# EAGLE design Main (EAGLE 9.3.0)
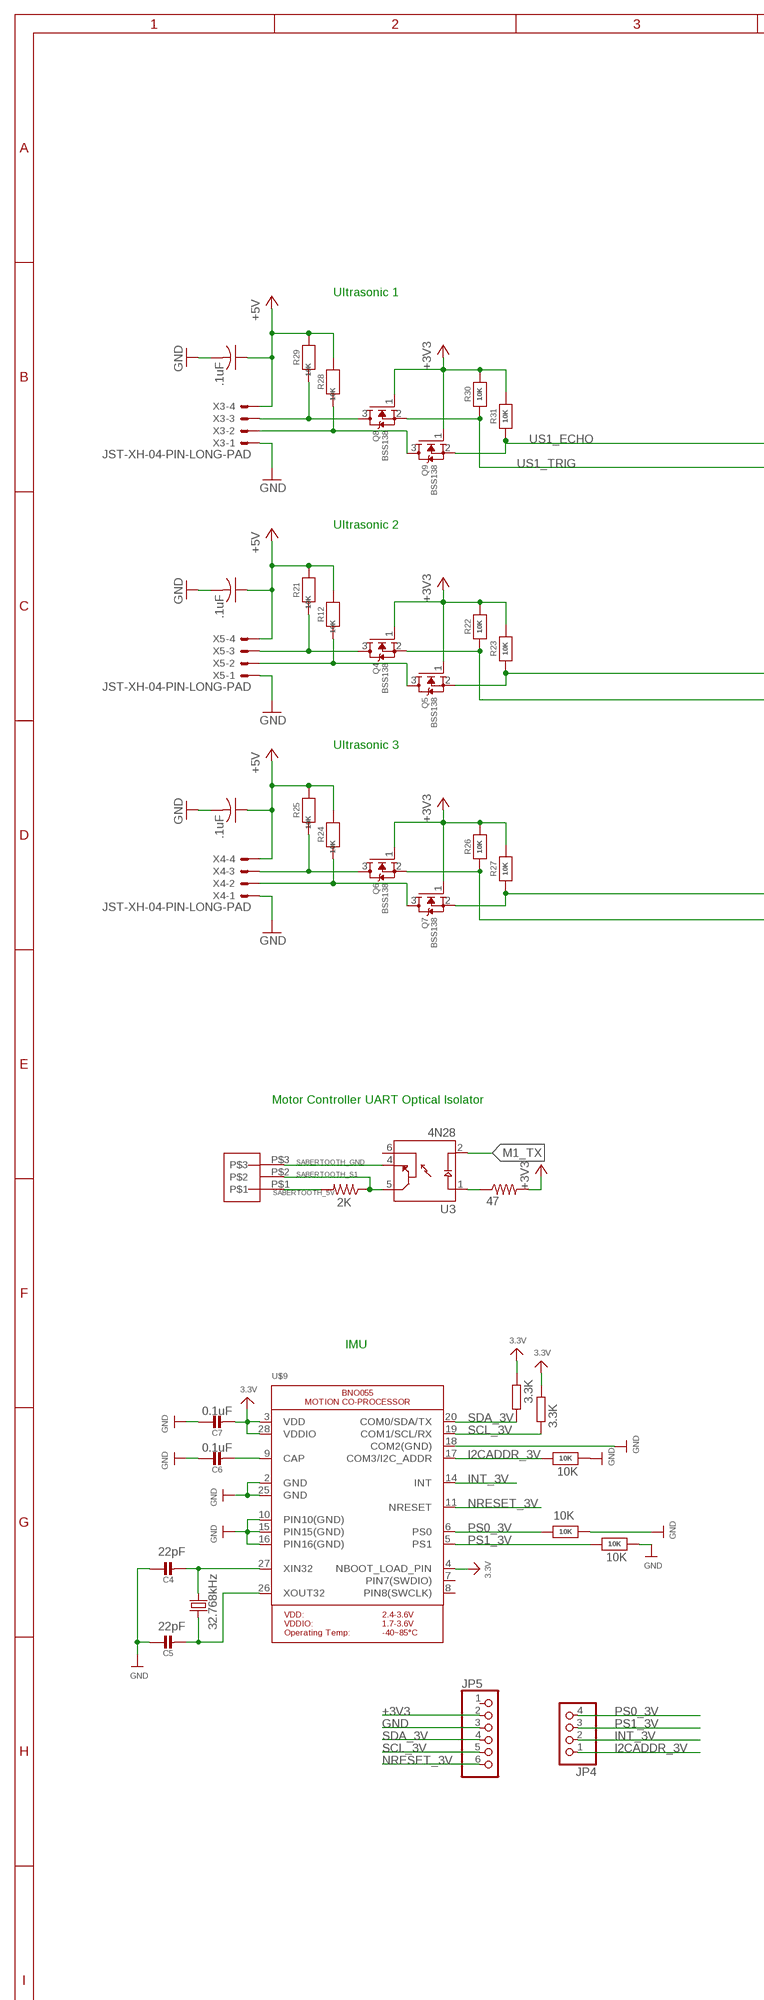
[diagram p0: schematic, sheet 1, part 1 of 2]
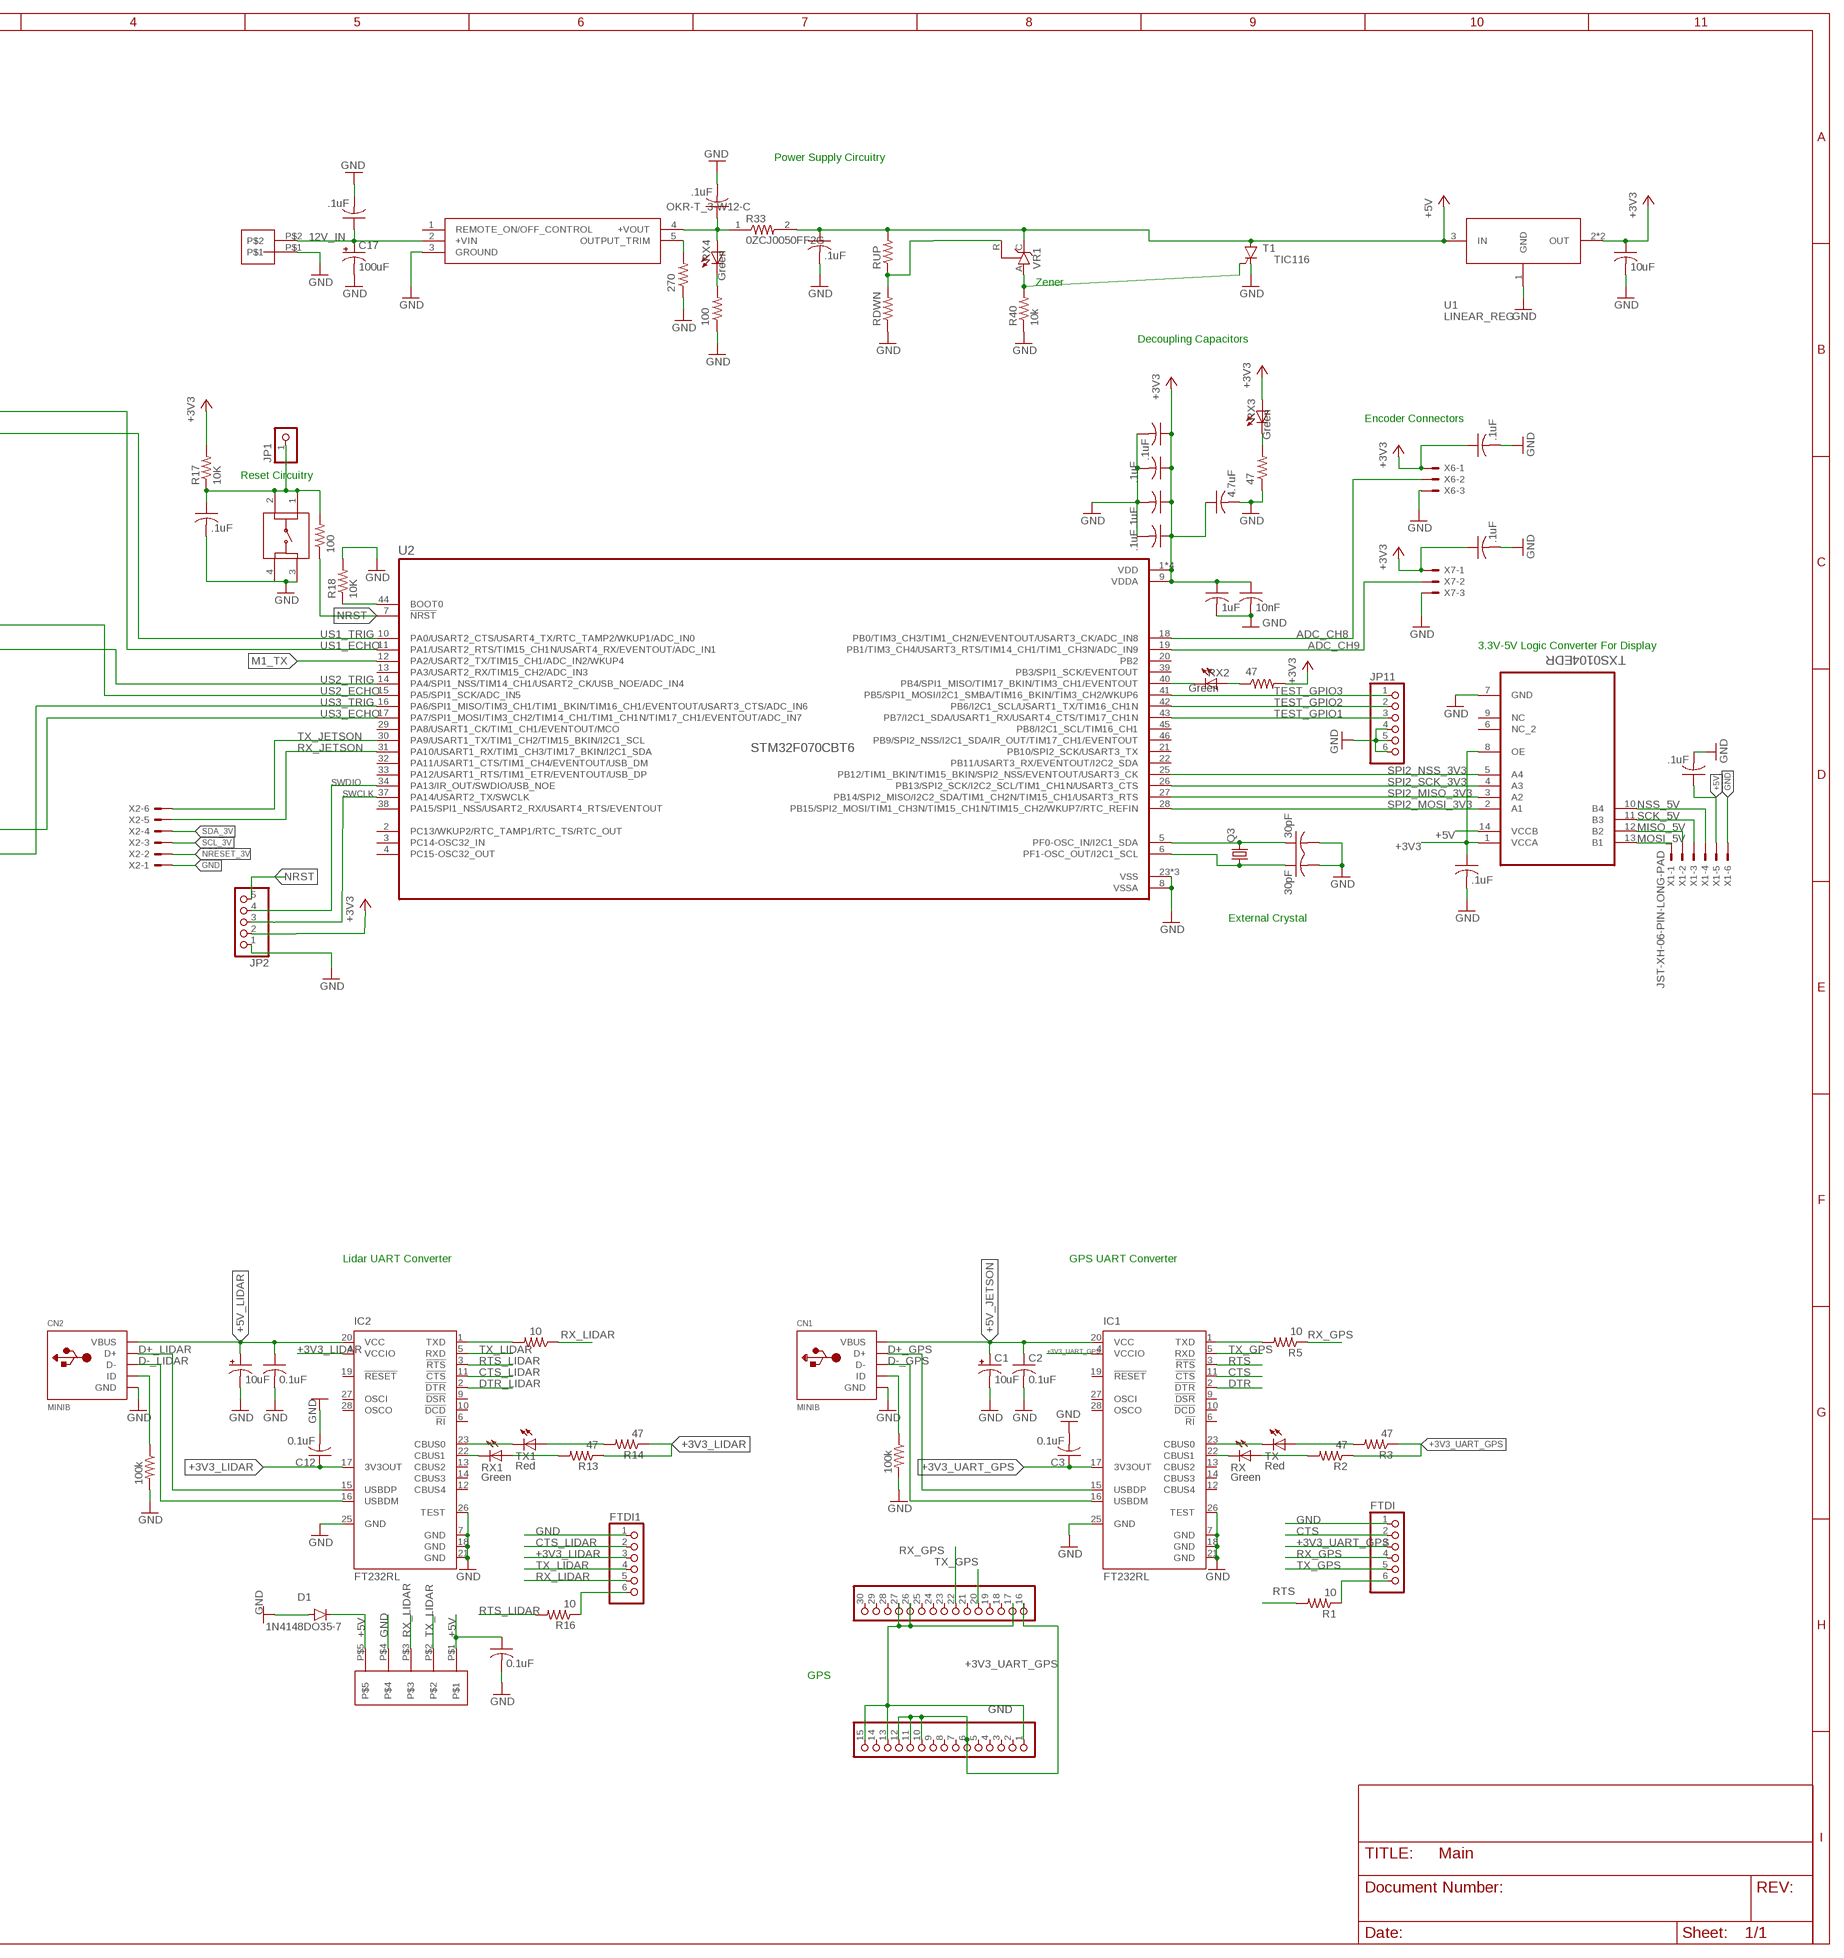
[diagram p1: schematic, sheet 1, part 2 of 2]

## Parts
C1  10uF  CPOL-USA/3216-18R  [A/3216-18R]
C2  0.1uF  C-USC0805K  [C0805K]
C3  0.1uF  C-USC0805K  [C0805K]
C4  22pF  CAP_CERAMIC0805-NOOUTLINE  [0805-NO]
C5  22pF  CAP_CERAMIC0805-NOOUTLINE  [0805-NO]
C6  0.1uF  CAP_CERAMIC0805-NOOUTLINE  [0805-NO]
C7  0.1uF  CAP_CERAMIC0805_10MGAP  [0805_10MGAP]
C8  .1uF  C-USC0805  [C0805]
C9  10uF  C-USC0805  [C0805]
C10  10uF  CPOL-USA/3216-18R  [A/3216-18R]
C11  0.1uF  C-USC0805K  [C0805K]
C12  0.1uF  C-USC0805K  [C0805K]
C13  .1uF  C-USC0805  [C0805]
C14  30pF  C-USC0805  [C0805]
C15  30pF  C-USC0805  [C0805]
C16  4.7uF  C-USC0805  [C0805]
C17  100uF  CPOL-USE2.5-7  [E2,5-7]
C18  .1uF  C-USC0805  [C0805]
C19  .1uF  C-USC0805  [C0805]
C20  1uF  C-USC0805  [C0805]
C21  10nF  C-USC0805  [C0805]
C22  .1uF  C-USC0805  [C0805]
C23  .1uF  C-USC0805  [C0805]
C24  .1uF  C-USC0805  [C0805]
C25  .1uF  C-USC0805  [C0805]
C26  .1uF  C-USC0805  [C0805]
C27  .1uF  C-USC0805  [C0805]
C28  .1uF  C-USC0805  [C0805]
C29  .1uF  C-USC0805  [C0805]
C30  0.1uF  C-USC0805K  [C0805K]
C31  .1uF  C-USC0805  [C0805]
C32  .1uF  C-USC0805  [C0805]
C33  .1uF  C-USC0805  [C0805]
CN1  MINIB  USBMINIB  [USB-MINIB]
CN2  MINIB  USBMINIB  [USB-MINIB]
D1  1N4148DO35-7  [DO35-7]
FTDI  PINHD-1X6CB  [1X06-CLEANBIG]
FTDI1  PINHD-1X6CB  [1X06-CLEANBIG]
IC1  FT232RL  [SSOP28]
IC2  FT232RL  [SSOP28]
IC4  OKR-T_3-W12-C  [MURATACASEC72]
J1  3_PIN_JST-XH  [3_PIN_JST-XH]
J2  2_PIN_JST-XH  [2_PIN_JST-XH]
J3  5_PIN_JST-XH  [5_PIN_JST-XH]
JP1  PINHD-1X1  [1X01]
JP2  PINHD-1X5  [1X05]
JP4  HEADER-1X476MIL  [1X04_ROUND_76]
JP5  MICROBUILDER_HEADER-1X676MIL  [MICROBUILDER_1X06_ROUND_76]
JP11  PINHD-1X6  [1X06]
Q3  CRYSTALHC49S  [HC49/S]
Q4  BSS138  MOSFET-NWIDE  [SOT23-WIDE]
Q5  BSS138  MOSFET-NWIDE  [SOT23-WIDE]
Q6  BSS138  MOSFET-NWIDE  [SOT23-WIDE]
Q7  BSS138  MOSFET-NWIDE  [SOT23-WIDE]
Q8  BSS138  MOSFET-NWIDE  [SOT23-WIDE]
Q9  BSS138  MOSFET-NWIDE  [SOT23-WIDE]
R1  10  R-US_R0805  [R0805]
R2  47  R-US_R0805  [R0805]
R3  47  R-US_R0805  [R0805]
R4  10K  RESISTOR0805_NOOUTLINE  [0805-NO]
R5  10  R-US_R0805  [R0805]
R6  10K  RESISTOR0805_NOOUTLINE  [0805-NO]
R7  10K  RESISTOR0805_NOOUTLINE  [0805-NO]
R8  3.3K  R-EU_R0805  [R0805]
R9  3.3K  R-EU_R0805  [R0805]
R10  47  R-US_R0805  [R0805]
R11  47  R-US_R0805  [R0805]
R12  10K  RESISTOR_0805MP  [_0805MP]
R13  47  R-US_R0805  [R0805]
R14  47  R-US_R0805  [R0805]
R15  10  R-US_R0805  [R0805]
R16  10  R-US_R0805  [R0805]
R17  10K  R-US_R0805  [R0805]
R18  10K  R-US_R0805  [R0805]
R19  47  R-US_R0805  [R0805]
R20  2K  R-US_R0805  [R0805]
R21  10K  RESISTOR_0805MP  [_0805MP]
R22  10K  RESISTOR0805_NOOUTLINE  [0805-NO]
R23  10K  RESISTOR0805_NOOUTLINE  [0805-NO]
R24  10K  RESISTOR_0805MP  [_0805MP]
R25  10K  RESISTOR_0805MP  [_0805MP]
R26  10K  RESISTOR0805_NOOUTLINE  [0805-NO]
R27  10K  RESISTOR0805_NOOUTLINE  [0805-NO]
R28  10K  RESISTOR_0805MP  [_0805MP]
R29  10K  RESISTOR_0805MP  [_0805MP]
R30  10K  RESISTOR0805_NOOUTLINE  [0805-NO]
R31  10K  RESISTOR0805_NOOUTLINE  [0805-NO]
R32  100  R-US_R0805  [R0805]
R33  0ZCJ0050FF2G  [RESC3216X125N]
R34  100k  R-US_R0805  [R0805]
R35  100k  R-US_R0805  [R0805]
R36  270  R-US_R0805  [R0805]
R37  100  R-US_R0805  [R0805]
R40  10k  R-US_R0805  [R0805]
RDWN  R-US_R0805  [R0805]
RESET  TACTILE_SWITCH  [SW_1825910-6-4]
RUP  R-US_R0805  [R0805]
RX  Green  LEDCHIP-LED0805  [CHIP-LED0805]
RX1  Green  LEDCHIP-LED0805  [CHIP-LED0805]
RX2  Green  LEDCHIP-LED0805  [CHIP-LED0805]
RX3  Green  LEDCHIP-LED0805  [CHIP-LED0805]
RX4  Green  LEDCHIP-LED0805  [CHIP-LED0805]
T1  TIC116  [TO220CS]
TX  Red  LEDCHIP-LED0805  [CHIP-LED0805]
TX1  Red  LEDCHIP-LED0805  [CHIP-LED0805]
U1  LINEAR_REG  [SOT223]
U2  STM32F070CBT6  [QFP50P900X900X160-48N]
U3  4N28  [DIP880W50P254L780H450Q6]
U4  TXS0104EDR  [SOIC127P600X175-14N]
U$1  GPS  [GPS]
U$9  MICROBUILDER_BNO055  [MICROBUILDER_BNO055]
VR1  TL431CLP  [TO92-CLP]
X1  JST-XH-06-PIN-LONG-PAD  [JST-XH-06-PACKAGE-LONG-PAD]
X2  JST-XH-06-PIN-LONG-PAD  [JST-XH-06-PACKAGE-LONG-PAD]
X3  JST-XH-04-PIN-LONG-PAD  [JST-XH-04-PACKAGE-LONG-PAD]
X4  JST-XH-04-PIN-LONG-PAD  [JST-XH-04-PACKAGE-LONG-PAD]
X5  JST-XH-04-PIN-LONG-PAD  [JST-XH-04-PACKAGE-LONG-PAD]
X6  JST-XH-03-PIN-LONG-PAD  [JST-XH-03-PACKAGE-LONG-PAD]
X7  JST-XH-03-PIN-LONG-PAD  [JST-XH-03-PACKAGE-LONG-PAD]
Y1  32.768kHz  CRYSTAL8.0X3.8  [CRYSTAL_8X3.8]

## Nets
12V_IN: C17.+ C32.1 IC4.2(+VIN) J2.P$2
+3V3: C7.2 C9.1 C16.1 C20.1 C21.1 C22.1 C23.1 C24.1 C25.1 C28.1 C29.1 C33.1 JP2.2 JP5.2 Q4.1(G) Q5.1(G) Q6.1(G) Q7.1(G) Q8.1(G) Q9.1(G) R8.2 R9.2 R10.2 R17.2 R19.2 R22.2 R23.2 R26.2 R27.2 R30.2 R31.2 RX3.A U1.2(OUT) U1.4(OUT) U2.1(VDD) U2.9(VDDA) U2.24(VDD) U2.36(VDD) U2.48(VDD) U4.1(VCCA) U4.8(OE) U$9.3(VDD) U$9.4(NBOOT_LOAD_PIN) U$9.28(VDDIO) X6.1 X7.1 ; supply symbol labelled 3.3V
+3V3_LIDAR: C12.1 FTDI1.3 IC2.4(VCCIO) IC2.17(3V3OUT) R13.1 R14.1
+3V3_UART_GPS: C3.1 FTDI.3 IC1.4(VCCIO) IC1.17(3V3OUT) R2.1 R3.1 U$1.6 U$1.10 U$1.11 U$1.12 U$1.16
+5V: C8.1 C18.1 C19.1 C26.1 C27.1 C30.1 D1.C J3.P$1 J3.P$5 R12.2 R21.2 R24.2 R25.2 R28.2 R29.2 R33.2 RUP.2 T1.A U1.3(IN) U4.14(VCCB) VR1.C X1.5 X3.4 X4.4 X5.4
+5V_JETSON: C1.+ C2.1 CN1.VBUS IC1.20(VCC)
+5V_LIDAR: C10.+ C11.1 CN2.VBUS IC2.20(VCC)
ADC_CH8: U2.18(PB0/TIM3_CH3/TIM1_CH2N/EVENTOUT/USART3_CK/ADC_IN8) X6.2
ADC_CH9: U2.19(PB1/TIM3_CH4/USART3_RTS/TIM14_CH1/TIM1_CH3N/ADC_IN9) X7.2
BOOT0: R18.1 U2.44(BOOT0)
CAP: C6.2 U$9.9(CAP)
CTS: FTDI.2 IC1.11(!CTS)
CTS_LIDAR: FTDI1.2 IC2.11(!CTS)
D+_GPS: CN1.D+ IC1.15(USBDP)
D+_LIDAR: CN2.D+ IC2.15(USBDP)
D-_GPS: CN1.D- IC1.16(USBDM)
D-_LIDAR: CN2.D- IC2.16(USBDM)
DTR: IC1.2(!DTR)
DTR_LIDAR: IC2.2(!DTR)
GND: C1.- C2.2 C3.2 C4.1 C5.1 C6.1 C7.1 C8.2 C9.2 C10.- C11.2 C12.2 C13.2 C14.2 C15.2 C16.2 C17.- C18.2 C19.2 C20.2 C21.2 C22.2 C23.2 C24.2 C25.2 C26.2 C27.2 C28.2 C29.2 C30.2 C31.2 C32.2 C33.2 CN1.GND CN2.GND D1.A FTDI1.1 FTDI.1 IC1.7(GND) IC1.18(GND) IC1.21(GND) IC1.25(GND) IC1.26(TEST) IC2.7(GND) IC2.18(GND) IC2.21(GND) IC2.25(GND) IC2.26(TEST) IC4.3(GROUND) J2.P$1 J3.P$4 JP2.1 JP5.3 JP11.4 JP11.5 JP11.6 R4.2 R6.2 R7.2 R11.1 R18.2 R32.1 R34.2 R35.2 R36.1 R40.1 RDWN.1 RESET.3 RESET.4 T1.C U1.1(GND) U2.8(VSSA) U2.23(VSS) U2.35(VSS) U2.47(VSS) U4.7(GND) U$1.1 U$1.13 U$1.15 U$1.17 U$1.26 U$1.27 U$9.2(GND) U$9.10(PIN10(GND)) U$9.15(PIN15(GND)) U$9.16(PIN16(GND)) U$9.18(COM2(GND)) U$9.25(GND) X1.6 X2.1 X3.1 X4.1 X5.1 X6.3 X7.3
I2CADDR_3V: JP4.1 R7.1 U$9.17(COM3/I2C_ADDR)
INT_3V: JP4.2 U$9.14(INT)
LED: RX2.C U2.40(PB4/SPI1_MISO/TIM17_BKIN/TIM3_CH1/EVENTOUT)
M1_TX: U2.12(PA2/USART2_TX/TIM15_CH1/ADC_IN2/WKUP4) U3.2(C_D)
MISO_5V: U4.12(B2) X1.2
MOSI_5V: U4.13(B1) X1.1
N$1: C4.2 U$9.27(XIN32) Y1.P$4
N$2: FTDI.6 R1.1
N$3: R10.1 RX2.A
N$4: R11.2 RX3.C
N$5: IC1.1(TXD) R5.2
N$6: IC1.23(CBUS0) TX.C
N$7: IC1.22(CBUS1) RX.C
N$8: R2.2 RX.A
N$9: R3.2 TX.A
N$10: C5.2 U$9.26(XOUT32) Y1.P$1
N$11: CN2.ID R34.1
N$12: R32.2 RX4.C
N$13: CN1.ID R35.1
N$14: IC2.23(CBUS0) TX1.C
N$15: IC2.22(CBUS1) RX1.C
N$16: R13.2 RX1.A
N$17: R14.2 TX1.A
N$18: IC2.1(TXD) R15.2
N$19: FTDI1.6 R16.1
N$20: IC4.5(OUTPUT_TRIM) R36.2
N$21: C31.1 IC4.4(+VOUT) R33.1 RX4.A
N$22: Q4.3(D) R21.1 X5.3
N$23: Q5.3(D) R12.1 X5.2
N$24: R40.2 T1.G VR1.A
N$25: RDWN.2 RUP.1 VR1.R
N$26: Q6.3(D) R25.1 X4.3
N$27: Q7.3(D) R24.1 X4.2
N$29: R19.1 U3.1(A_D)
N$36: C14.1 Q3.2 U2.5(PF0-OSC_IN/I2C1_SDA)
N$37: C15.1 Q3.1 U2.6(PF1-OSC_OUT/I2C1_SCL)
N$48: Q8.3(D) R29.1 X3.3
N$49: Q9.3(D) R28.1 X3.2
NRESET_3V: JP5.6 U$9.11(NRESET) X2.2
NRST: JP2.5 R37.1 U2.7(!NRST)
NSS_5V: U4.10(B4) X1.4
PS0_3V: JP4.4 R4.1 U$9.6(PS0)
PS1_3V: JP4.3 R6.1 U$9.5(PS1)
RESET: C13.1 JP1.1 R17.1 R37.2 RESET.1 RESET.2
RTS: IC1.3(!RTS) R1.2
RTS_LIDAR: IC2.3(!RTS) R16.2
RX_GPS: FTDI.4 R5.1 U$1.22
RX_JETSON: U2.31(PA10/USART1_RX/TIM1_CH3/TIM17_BKIN/I2C1_SDA) X2.5
RX_LIDAR: FTDI1.5 J3.P$3 R15.1
SABERTOOTH_5V: J1.P$1 R20.2
SABERTOOTH_GND: J1.P$3 U3.4(E_T)
SABERTOOTH_S1: J1.P$2 R20.1 U3.5(C_T)
SCK_5V: U4.11(B3) X1.3
SCL_3V: JP5.5 R9.1 U$9.19(COM1/SCL/RX) X2.3
SDA_3V: JP5.4 R8.1 U$9.20(COM0/SDA/TX) X2.4
SPI2_MISO_3V3: U2.27(PB14/SPI2_MISO/I2C2_SDA/TIM1_CH2N/TIM15_CH1/USART3_RTS) U4.3(A2)
SPI2_MOSI_3V3: U2.28(PB15/SPI2_MOSI/TIM1_CH3N/TIM15_CH1N/TIM15_CH2/WKUP7/RTC_REFIN) U4.2(A1)
SPI2_NSS_3V3: U2.25(PB12/TIM1_BKIN/TIM15_BKIN/SPI2_NSS/EVENTOUT/USART3_CK) U4.5(A4)
SPI2_SCK_3V3: U2.26(PB13/SPI2_SCK/I2C2_SCL/TIM1_CH1N/USART3_CTS) U4.4(A3)
SWCLK: JP2.3 U2.37(PA14/USART2_TX/SWCLK)
SWDIO: JP2.4 U2.34(PA13/IR_OUT/SWDIO/USB_NOE)
TEST_GPIO1: JP11.3 U2.43(PB7/I2C1_SDA/USART1_RX/USART4_CTS/TIM17_CH1N)
TEST_GPIO2: JP11.2 U2.42(PB6/I2C1_SCL/USART1_TX/TIM16_CH1N)
TEST_GPIO3: JP11.1 U2.41(PB5/SPI1_MOSI/I2C1_SMBA/TIM16_BKIN/TIM3_CH2/WKUP6)
TX_GPS: FTDI.5 IC1.5(RXD) U$1.20
TX_JETSON: U2.30(PA9/USART1_TX/TIM1_CH2/TIM15_BKIN/I2C1_SCL) X2.6
TX_LIDAR: FTDI1.4 IC2.5(RXD) J3.P$2
US1_ECHO: Q9.2(S) R31.1 U2.11(PA1/USART2_RTS/TIM15_CH1N/USART4_RX/EVENTOUT/ADC_IN1)
US1_TRIG: Q8.2(S) R30.1 U2.10(PA0/USART2_CTS/USART4_TX/RTC_TAMP2/WKUP1/ADC_IN0)
US2_ECHO: Q5.2(S) R23.1 U2.15(PA5/SPI1_SCK/ADC_IN5)
US2_TRIG: Q4.2(S) R22.1 U2.14(PA4/SPI1_NSS/TIM14_CH1/USART2_CK/USB_NOE/ADC_IN4)
US3_ECHO: Q7.2(S) R27.1 U2.17(PA7/SPI1_MOSI/TIM3_CH2/TIM14_CH1/TIM1_CH1N/TIM17_CH1/EVENTOUT/ADC_IN7)
US3_TRIG: Q6.2(S) R26.1 U2.16(PA6/SPI1_MISO/TIM3_CH1/TIM1_BKIN/TIM16_CH1/EVENTOUT/USART3_CTS/ADC_IN6)
Unconnected: IC1.6(!RI) IC1.9(!DSR) IC1.10(!DCD) IC1.12(CBUS4) IC1.13(CBUS2) IC1.14(CBUS3) IC1.19(!RESET) IC1.27(OSCI) IC1.28(OSCO) IC2.6(!RI) IC2.9(!DSR) IC2.10(!DCD) IC2.12(CBUS4) IC2.13(CBUS2) IC2.14(CBUS3) IC2.19(!RESET) IC2.27(OSCI) IC2.28(OSCO) IC4.1(REMOTE_ON/OFF_CONTROL) JP5.1 U2.2(PC13/WKUP2/RTC_TAMP1/RTC_TS/RTC_OUT) U2.3(PC14-OSC32_IN) U2.4(PC15-OSC32_OUT) U2.13(PA3/USART2_RX/TIM15_CH2/ADC_IN3) U2.20(PB2) U2.21(PB10/SPI2_SCK/USART3_TX) U2.22(PB11/USART3_RX/EVENTOUT/I2C2_SDA) U2.29(PA8/USART1_CK/TIM1_CH1/EVENTOUT/MCO) U2.32(PA11/USART1_CTS/TIM1_CH4/EVENTOUT/USB_DM) U2.33(PA12/USART1_RTS/TIM1_ETR/EVENTOUT/USB_DP) U2.38(PA15/SPI1_NSS/USART2_RX/USART4_RTS/EVENTOUT) U2.39(PB3/SPI1_SCK/EVENTOUT) U2.45(PB8/I2C1_SCL/TIM16_CH1) U2.46(PB9/SPI2_NSS/I2C1_SDA/IR_OUT/TIM17_CH1/EVENTOUT) U3.6(B_T) U4.6(NC_2) U4.9(NC) U$1.2 U$1.3 U$1.4 U$1.5 U$1.7 U$1.8 U$1.9 U$1.14 U$1.18 U$1.19 U$1.21 U$1.23 U$1.24 U$1.25 U$1.28 U$1.29 U$1.30 U$9.7(PIN7(SWDIO)) U$9.8(PIN8(SWCLK))

## Notes on the sheet
- Power Supply Circuitry
- Ultrasonic 1
- Zener
- Decoupling Capacitors
- Encoder Connectors
- Reset Circuitry
- Ultrasonic 2
- 3.3V-5V Logic Converter For Display
- Ultrasonic 3
- External Crystal
- Motor Controller UART Optical Isolator
- IMU
- Lidar UART Converter | GPS UART Converter
- 10K
- 10K
- 10K
- GPS

## Library data of the parts
C1 C10 = adafruit:CPOL-US: POLARIZED CAPACITOR, American symbol
C2 C3 C11 C12 C30 = adafruit:C-US: CAPACITOR, American symbol
C4-C7 = microbuilder:CAP_CERAMIC: Ceramic Capacitors For new designs, use the packages preceded by an '_' character since they are more reliable: The following footprints should be used on most boards: _0402 - Standard footprint for regular board layouts _0603 - Standard footprint for regular board layouts _0805 - Standard footprint for regular board layouts _1206 - Standard footprint for regular board layouts For extremely tight-pitch boards where space is at a premium, the following 'micro-pitch' footprints can be used (smaller pads, no silkscreen outline, etc.): _0402MP - Micro-pitch footprint for very dense/compact boards _0603MP - Micro-pitch footprint for very dense/compact boards _0805MP - Micro-pitch footprint for very dense/compact boards _1206MP - Micro-pitch footprint for very dense/compact boards
C8 C9 C13-C16 C18-C20 C22-C29 C31-C33 = rcl:C-US: CAPACITOR, American symbol; SPICEPREFIX: C
C17 = rcl:CPOL-US: POLARIZED CAPACITOR, American symbol; SPICEPREFIX: C
C21 = rcl:C-US: CAPACITOR, American symbol; SPICEPREFIX: 10nF
CN1 CN2 = adafruit:USB: USB Connectors USBMINIB - Surface Mount Female Mini-B USB Connector 4UConnector: 06564 By microbuilder.eu Thru-hole RA Female Mini-B USB Connector 4UConnector: 18732 By ladyada.net
D1 = diode:1N4148: DIODE high speed (Philips)
FTDI FTDI1 = adafruit:PINHD-1X6: PIN HEADER
IC1 IC2 = ftdichip:FT232R: Source: http://www.ftdichip.com/Documents/DataSheets/DS_FT232R_v104.pdf; MPN: FT232RL; OC_FARNELL: 1146032; OC_NEWARK: 91K9918
IC4 = SamacSys_Parts:OKR-T_3-W12-C: Non-Isolated DC-DC Converter 12V dc Input, 0.591 ??6V dc Output, 3A%0 Source: Datasheet <http://www.mouser.com/datasheet/2/281/okr-t3-w12-21655.pdf>; DESCRIPTION: Non-Isolated DC-DC Converter 12V dc Input, 0.591 ??6V dc Output, 3A%0; HEIGHT: mm; MANUFACTURER_NAME: Murata Electronics; MANUFACTURER_PART_NUMBER: OKR-T/3-W12-C; MOUSER_PART_NUMBER: 580-OKR-T/3-W12-C; MOUSER_PRICE-STOCK: https://www.mouser.com/Search/Refine.aspx?Keyword=580-OKR-T%2F3-W12-C
J1 = main_library:3_PIN_JST-XH: Corrected for XH 3 pin dmf 4.10.15 Source info: http://www.jst-mfg.com/product/pdf/eng/eXH.pdf Note: pin spacing is 2.5 mm Note: pins are 0.64 mm square cross section. This means the pin diagonal is 0.905 mm. Hole diameter spec'd by jst is 0.9 mm; hole diameter used here is 1.0 mm
J2 = main_library:2_PIN_JST-XH: Corrected for XH 2 pin dmf 4.10.15 Source info: http://www.jst-mfg.com/product/pdf/eng/eXH.pdf Note: pin spacing is 2.5 mm Note: pins are 0.64 mm square cross section. This means the pin diagonal is 0.905 mm. Hole diameter spec'd by jst is 0.9 mm; hole diameter used here is 1.0 mm
J3 = main_library:5_PIN_JST-XH
JP1 = pinhead:PINHD-1X1: PIN HEADER
JP2 = pinhead:PINHD-1X5: PIN HEADER
JP4 = microbuilder:HEADER-1X4: PIN HEADER
JP5 = main_library:MICROBUILDER_HEADER-1X6: PIN HEADER
JP11 = pinhead:PINHD-1X6: PIN HEADER
Q3 = crystal:CRYSTAL: CRYSTAL; OC_FARNELL: 1667008; OC_NEWARK: unknown
Q4-Q9 = microbuilder:MOSFET-N: N-Channel Mosfet LEGEND VDS: Voltage Drain-Source ID: Drain Current RDS(ON): Drain-Source On-State Resistance VGS(TH): Gate-Source Threshold Voltage CISS: Drain-Source Input Capacitance SOT-23 Name VDS ID RDS(ON) VGS(TH) CISS Order Number 2N7002E 60V 260mA 2.5 Ohm 2.5V @ 250uA 26.7pF @ 25V 2N7002ET1GOSTR-ND BSH103 30V 850mA 400 mOhm 400mV @ 1mA 83pF @ 24V BSH103,235-ND BSS138 60V 320mA 1.6 Ohm 1.5V @ 250uA 50pF @ 10V Mouser: 771-BSS138PW115 DMN2075U-7 20V 4.2A 38 mOhm 1V @ 250 uA 594.3pF @ 10V DMN2075U-7DICT-ND * BSS138 good choice for I2C level-shifting POWERPAK 1212-8 Name VDS ID RDS(ON) VGS(TH) CISS Order Number Si7308DN 60V 6A 58 mOhm 3V @ 250uA 665pF @ 15V SI7308DN-T1-E3CT-ND
R1-R3 R5 R13-R16 R34 R35 = adafruit:R-US_: RESISTOR, American symbol
R4 R6 R7 R12 R21-R31 = microbuilder:RESISTOR: Resistors For new designs, use the packages preceded by an '_' character since they are more reliable: The following footprints should be used on most boards: _0402 - Standard footprint for regular board layouts _0603 - Standard footprint for regular board layouts _0805 - Standard footprint for regular board layouts _1206 - Standard footprint for regular board layouts For extremely tight-pitch boards where space is at a premium, the following 'micro-pitch' footprints can be used (smaller pads, no silkscreen outline, etc.): _0402MP - Micro-pitch footprint for very dense/compact boards _0603MP - Micro-pitch footprint for very dense/compact boards _0805MP - Micro-pitch footprint for very dense/compact boards _1206MP - Micro-pitch footprint for very dense/compact boards
R8 R9 = resistor:R-EU_: RESISTOR, European symbol
R10 R11 R17-R20 R32 R36 = rcl:R-US_: RESISTOR, American symbol; SPICEPREFIX: R
R33 = RESET_FUSE:0ZCJ0050FF2G: PTC Resettable Fuse100A 8VDC T/R; DESCRIPTION: PTC Resettable Fuse 0.5A_hold_ 1A_trip_ 8VDC 100A 0.4W 0.1s 0.15Ohm SMD Solder Pad 3.5 X 1.8 X 0.55mm T/R; DIGI-KEY_PART_NUMBER: 507-1802-1-ND; DIGI-KEY_PURCHASE_URL: https://www.digikey.com/product-detail/en/bel-fuse-inc/0ZCJ0050FF2G/507-1802-1-ND/4156236?utm_source=snapeda&utm_medium=aggregator&utm_campaign=symbol; MF: Bel Fuse; MP: 0ZCJ0050FF2G; PACKAGE: 1206 Bel Fuse
R37 R40 RDWN RUP = resistor:R-US_: RESISTOR, American symbol
RESET = main_library:TACTILE_SWITCH: Switch Tactile OFF (ON) SPST Round Button PC Pins 0.05A 24VDC 100000Cycles 1.57N Thru-Hole Loose; COMMENT: 1825910-6; CONFIGURATION_POLE-THROW: Single Pole - Single Throw; CONTACT_CURRENT_RATING: 50 mA; DESCRIPTION: FSM4JH=6MM TACT SWITCH, HIGH TEMP; DIGI-KEY_PART_NUMBER: 450-1650-ND; DIGI-KEY_PURCHASE_URL: https://www.digikey.com/product-detail/en/te-connectivity-alcoswitch-switches/1825910-6/450-1650-ND/1632536?utm_source=snapeda&utm_medium=aggregator&utm_campaign=symbol; EU_ROHS_COMPLIANCE: Compliant; MF: TE Connectivity; MP: 1825910-6; PACKAGE: None; TE_PURCHASE_URL: https://www.te.com/usa-en/product-1825910-6.html?te_bu=Cor&te_type=disp&te_campaign=seda_glo_cor-seda-global-disp-prtnr-fy19-seda-model-bom-cta_sma-317_1&elqCampaignId=32493
RX RX1-RX4 TX TX1 = adafruit:LED: LED OSRAM: - CHIPLED LG R971, LG N971, LY N971, LG Q971, LY Q971, LO R971, LY R971 LH N974, LH R974 LS Q976, LO Q976, LY Q976 LO Q996 - Hyper CHIPLED LW Q18S LB Q993, LB Q99A, LB R99A - SideLED LS A670, LO A670, LY A670, LG A670, LP A670 LB A673, LV A673, LT A673, LW A673 LH A674 LY A675 LS A676, LA A676, LO A676, LY A676, LW A676 LS A679, LY A679, LG A679 - Hyper Micro SIDELED® LS Y876, LA Y876, LO Y876, LY Y876 LT Y87S - SmartLED LW L88C, LW L88S LB L89C, LB L89S, LG L890 LS L89K, LO L89K, LY L89K LS L896, LA L896, LO L896, LY L896 - TOPLED LS T670, LO T670, LY T670, LG T670, LP T670 LSG T670, LSP T670, LSY T670, LOP T670, LYG T670 LG T671, LOG T671, LSG T671 LB T673, LV T673, LT T673, LW T673 LH T674 LS T676, LA T676, LO T676, LY T676, LB T676, LH T676, LSB T676, LW T676 LB T67C, LV T67C, LT T67C, LS T67K, LO T67K, LY T67K, LW E67C LS E67B, LA E67B, LO E67B, LY E67B, LB E67C, LV E67C, LT E67C LW T67C LS T679, LY T679, LG T679 LS T770, LO T770, LY T770, LG T770, LP T770 LB T773, LV T773, LT T773, LW T773 LH T774 LS E675, LA E675, LY E675, LS T675 LS T776, LA T776, LO T776, LY T776, LB T776 LHGB T686 LT T68C, LB T68C - Hyper Mini TOPLED® LB M676 - Mini TOPLED Santana® LG M470 LS M47K, LO M47K, LY M47K Source: http://www.osram.convergy.de/
T1 = triac:TIC116: THYRISTOR
U1 = main_library:LINEAR_REG: http://octopart.com/ld1117s33tr-stmicroelectronics-526708; DESCRIPTION: LD1117 Series 1300 mA 3.3 V Fixed Output Positive Voltage LDO Regulator- SOT-223; DIGI-KEY_PART_NUMBER: 497-1241-1-ND; DIGI-KEY_PURCHASE_URL: https://www.digikey.com/product-detail/en/stmicroelectronics/LD1117S33CTR/497-1241-1-ND/586241?utm_source=snapeda&utm_medium=aggregator&utm_campaign=symbol; MF: STMicroelectronics; MP: LD1117S33CTR; PACKAGE: SOT-223 STMicroelectronics
U2 = STM32F070CBT6:STM32F070CBT6: Entry-level ARM Cortex-M0 Value line MCU with up to 128 Kbytes Flash, 48 MHz CPU; DESCRIPTION: Entry-level ARM Cortex-M0 Value line MCU with up to 128 Kbytes Flash, 48 MHz CPU; DIGI-KEY_PART_NUMBER: 497-15099-ND; DIGI-KEY_PURCHASE_URL: https://www.digikey.com/product-detail/en/stmicroelectronics/STM32F070CBT6/497-15099-ND/5051734?utm_source=snapeda&utm_medium=aggregator&utm_campaign=symbol; MF: STMicroelectronics; MP: STM32F070CBT6; PACKAGE: LQFP-48 STMicroelectronics
U3 = main_library:4N28: Optocoupler DC-IN 1-CH Transistor With Base DC-OUT 6-Pin PDIP; AVAILABILITY: Unavailable; DESCRIPTION: Opto Coupler General Purpose 6 Pin Dip Photo Transistor; MF: Lite-On Inc.; MP: 4N28; PACKAGE: DIP-6 Vishay; PRICE: None
U4 = TXS0104EDR:TXS0104EDR: 4-BIT BIDIRECTIONAL VOLTAGE-LEVEL TRANSLATOR FOR OPEN-DRAIN AND PUSH-PULL APPLICATIONS; DESCRIPTION: 4-Bit Bidirectional Voltage-Level Shifter for Open-Drain and Push-Pull Applications 14-SOIC -40 to 85; DIGI-KEY_PART_NUMBER: 296-20696-1-ND; DIGI-KEY_PURCHASE_URL: https://www.digikey.com/product-detail/en/texas-instruments/TXS0104EDR/296-20696-1-ND/1143680?utm_source=snapeda&utm_medium=aggregator&utm_campaign=symbol; MF: Texas Instruments; MP: TXS0104EDR; PACKAGE: SOIC-14 Texas Instruments
U$1 = NS-HP-GL:GPS
U$9 = main_library:MICROBUILDER_BNO055: BNO055 - Motion Co-Processor
VR1 = v-reg:TL431CLP: VOLTAGE REGULATOR
X1 X2 = Rembrandt Electronics - JST XH Connectors v1-0:JST-XH-06-PIN: JST XH Connector 2 Pin Wire to board connector. Pitch: 2,54 mm, (0.100") Number of pins: 6 Created by Rembrandt Electronics www.rembrandtelectronics.com
X3-X5 = Rembrandt Electronics - JST XH Connectors v1-0:JST-XH-04-PIN: JST XH Connector 2 Pin Wire to board connector. Pitch: 2,54 mm, (0.100") Number of pins: 4 Created by Rembrandt Electronics www.rembrandtelectronics.com
X6 X7 = Rembrandt Electronics - JST XH Connectors v1-0:JST-XH-03-PIN: JST XH Connector 2 Pin Wire to board connector. Pitch: 2,54 mm, (0.100") Number of pins: 3 Created by Rembrandt Electronics www.rembrandtelectronics.com
Y1 = microbuilder:CRYSTAL: Crystals HC49UP - Surface Mount Crystal 4.0MHz 18pF +/-30ppm Surface Mount Crystal [Digikey: 535-9857-1-ND] 12.0 MHz Surface Mount Crystal [Digikey: 535-9869-6-ND] 25.0 MHz Surface Mount Crystal [Digikey: 535-9078-1-ND] 2.5 x 2.0mm - MEMs SMT Crystal 16.0 MHz 10pF 20ppm 2.5 x 2.0mm Crystal [Digikey -40-85°C: 535-10923-1-ND] 3.2 x 2.5mm - MEMs SMT Crystal 12.0 MHz 8pF 15ppm 3.2 x 2.5mm Crystal [Digikey: -10-70°C: 644-1047-1-ND -40-125°C: 644-1128-1-ND] 40~85°C cheaper: 644-1173-6-ND 16.0 MHz 8pF 15ppm 3.2 x 2.5mm Crystal [Digikey: -10-70°C: 644-1049-1-ND -40-125°C: 644-1129-2-ND]-40~85°C cheaper: 644-1175-6-ND 16.0 MHz 10pF 10ppm 3.2 x 2.5mm Crystal [Digikey: 644-1100-1-ND] 27.12 MHz 18pF 30ppm 3.2 x 2.5mm Crystal [Digikey: 887-1424-1-ND] 27.12MHz 10pF 10ppm 3.2 x 2.5mm Crystal [Digikey: 887-1329-1-ND] 4.9 x 1.8mm - MEMs SMT Crystal 32.768 KHz 12.5pF 20ppm 4.9 x 1.8mm Crystal [Digikey: SE2415CT-ND] 8.0 x 3.8mm - Surface Mount Crystal 32.768kHz 12.5pF 20ppm -40°C-85°C [Digikey: 535-9166-2-ND] Cylinder 32.768KHz Cylinder Crystal (2x6mm body) [Ex. Digikey: 300-8341-2-ND]

## Board
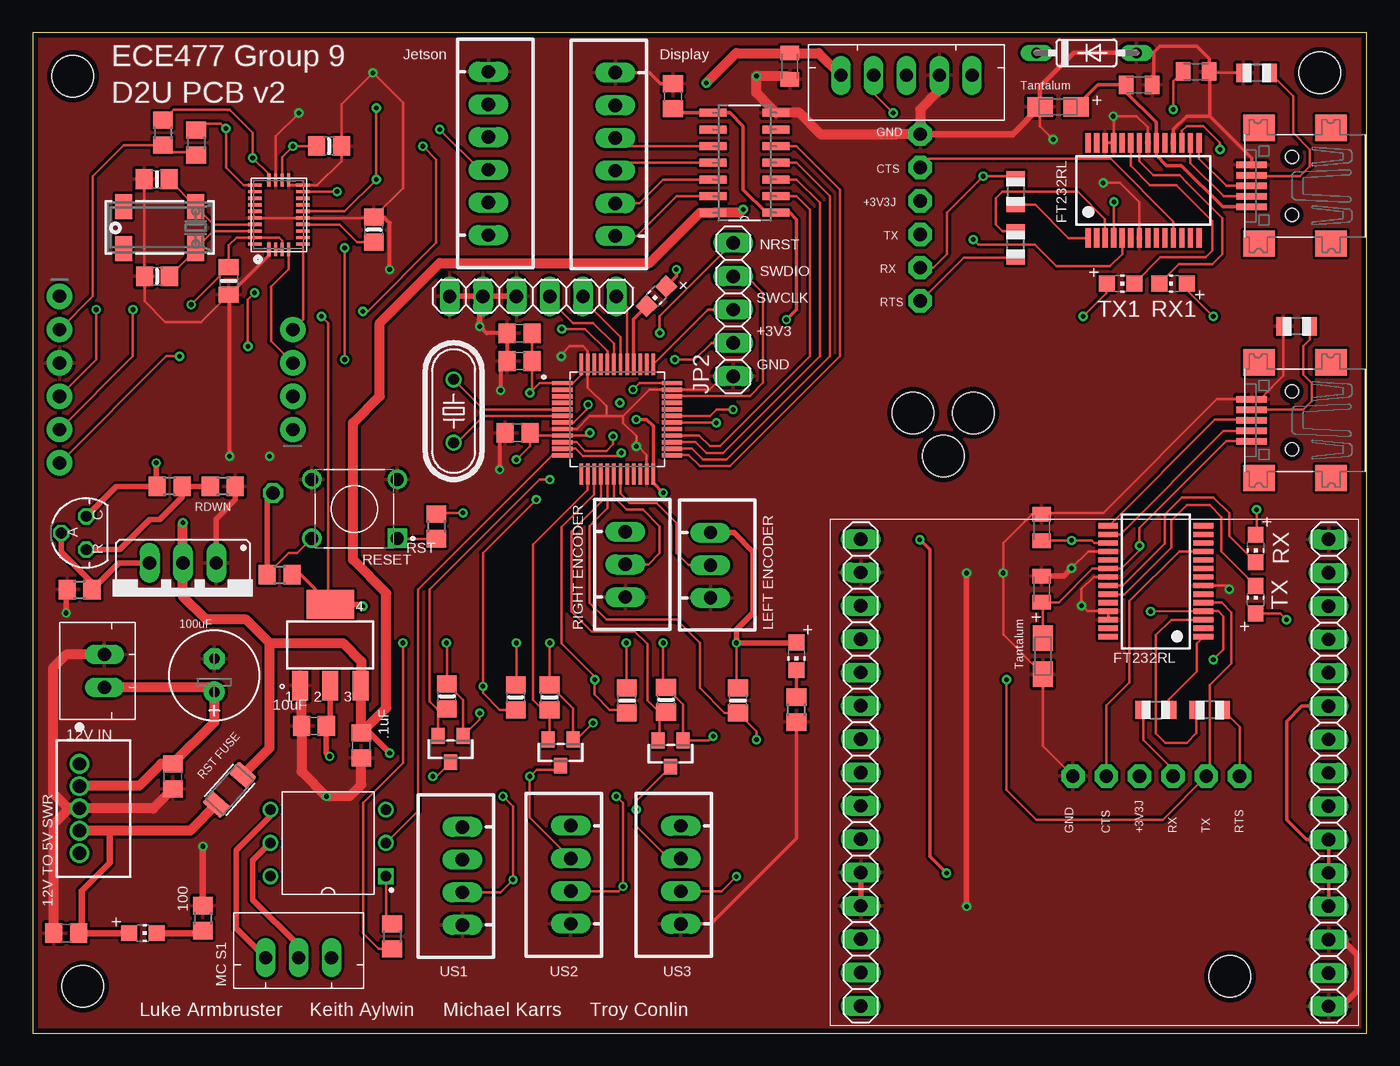
[diagram p2: board, top side]
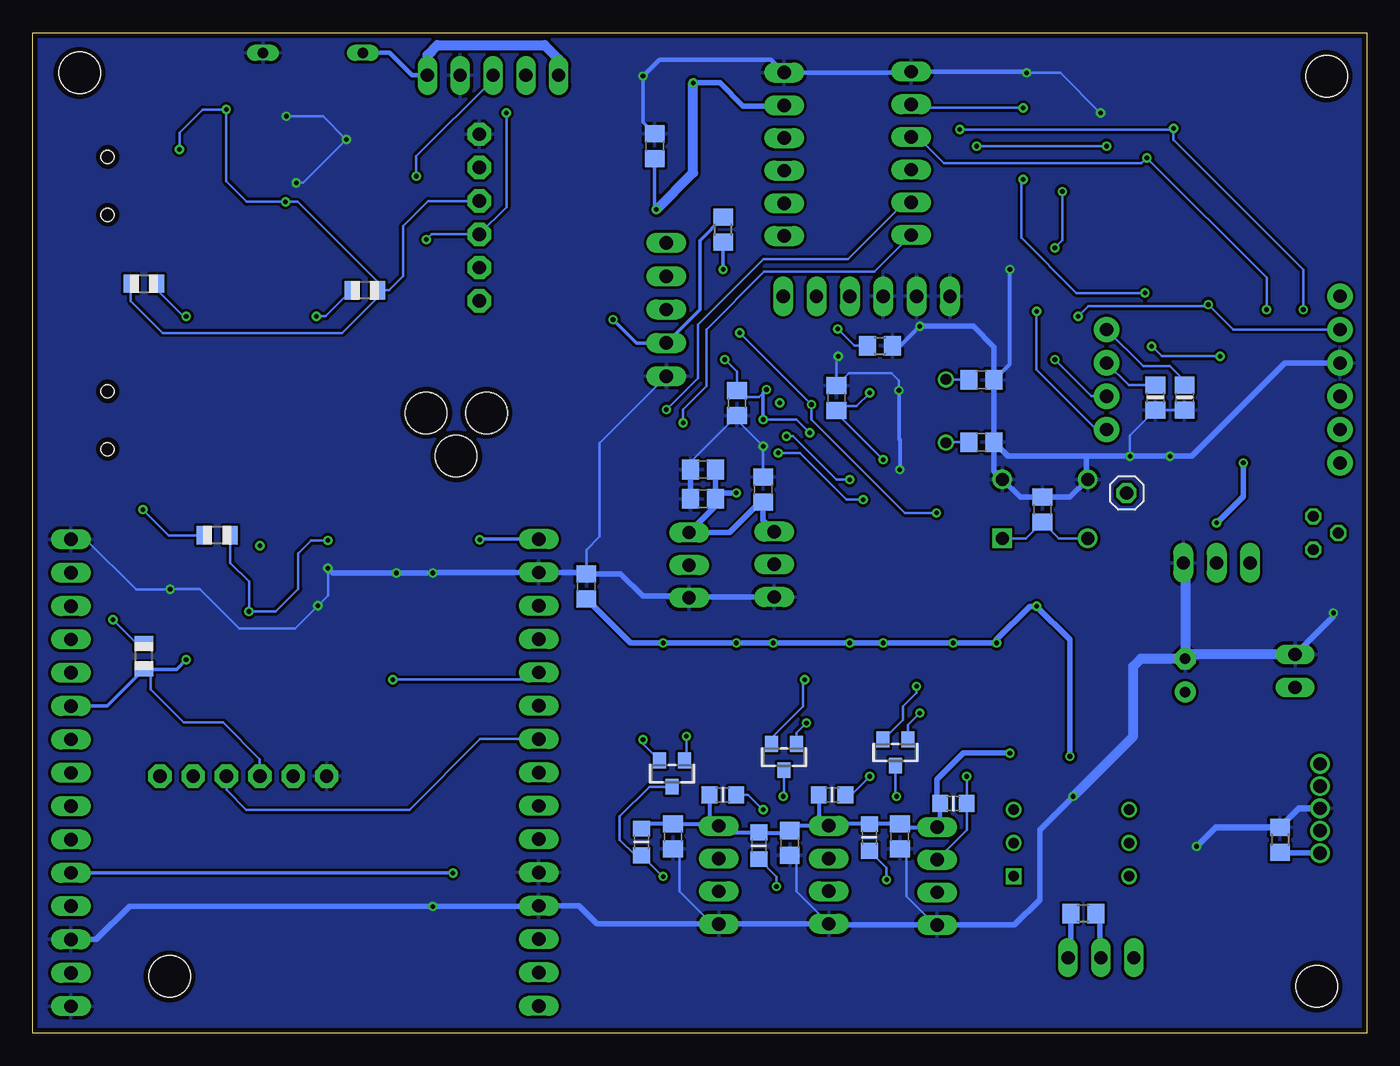
[diagram p3: board, bottom side, seen from below]

Size 101.6 x 76.2 mm. Coordinates in mm from the lower left corner, seen from the top.
Outline: 0,0 101.6,0 101.6,76.2 0,76.2 0,0
Copper layers (1*16): Top 0.0356mm / dielectric 1.5011mm / Bottom 0.0356mm
Design rules "ECE_Senior_Design": minimum track width 8mil, minimum drill 13mil, track to track 8mil, track to pad 8mil, pad to pad 6mil, via to via 8mil, smd to smd 6mil, copper to edge 15mil, drill to drill 8mil, minimum pad ring 7mil, minimum via ring 7mil, stop-mask expansion 3mil, vias tented up to drill 0mil, thermal gap 10mil
Holes 3.17 mm at 3.05,72.9 3.81,3.56 91.19,4.32 98.04,73.15 69.34,43.94 67.06,47.24 71.63,47.24

### Footprints (pad centres in the part's own frame; a part is rotated, then mirrored left to right if it is on the bottom)
A/3216-18R = smd 1.95 x 1.5: + 1.375,0; - -1.375,0
C0805K = smd 1.1 x 1.4: 1 -1,0; 2 1,0
0805-NO = smd 1.3 x 1.5: 1 -0.95,0; 2 0.95,0
0805_10MGAP = smd 1.2 x 1.5: 1 -1.05,0; 2 1.05,0
C0805 = smd 1.3 x 1.5: 1 -0.95,0; 2 0.95,0
E2,5-7 = drill 0.813 pad 1.6: + -1.27,0 | drill 0.813 pad 1.6 octagon: - 1.27,0
USB-MINIB = smd 0.5 x 2.308: D+ 0,4.064; D- -0.8,4.064; GND 1.6,4.064; ID 0.8,4.064; VBUS -1.6,4.064 | smd 2 x 2.4: GND1 -4.4,-2; GND2 -4.4,3.5; GND3 4.4,3.5; GND4 4.4,-2 | hole 1: -2.2,1; 2.2,1
DO35-7 = drill 0.813 long: A 3.81,0; C -3.81,0
1X06-CLEANBIG = drill 1.016 pad 1.778 octagon: 1 -6.35,0; 2 -3.81,0; 3 -1.27,0; 4 1.27,0; 5 3.81,0; 6 6.35,0
SSOP28 = smd 0.4 x 1.5: 1 -4.225,-3.625; 2 -3.575,-3.625; 3 -2.925,-3.625; 4 -2.275,-3.625; 5 -1.625,-3.625; 6 -0.975,-3.625; 7 -0.325,-3.625; 8 0.325,-3.625; 9 0.975,-3.625; 10 1.625,-3.625; 11 2.275,-3.625; 12 2.925,-3.625; 13 3.575,-3.625; 14 4.225,-3.625; 15 4.225,3.625; 16 3.575,3.625; 17 2.925,3.625; 18 2.275,3.625; 19 1.625,3.625; 20 0.975,3.625; 21 0.325,3.625; 22 -0.325,3.625; 23 -0.975,3.625; 24 -1.625,3.625; 25 -2.275,3.625; 26 -2.925,3.625; 27 -3.575,3.625; 28 -4.225,3.625
MURATACASEC72 = drill 1.01 pad 1.51: 1 6.8,0; 2 5.1,0; 3 3.4,0; 4 1.7,0; 5 0,0
3_PIN_JST-XH = drill 1 long: P$1 2.45,3.4; P$2 4.95,3.4; P$3 7.45,3.4
2_PIN_JST-XH = drill 1 long: P$1 2.45,3.4; P$2 4.95,3.4
5_PIN_JST-XH = drill 1 long: P$1 -5,0.06; P$2 -2.5,0.06; P$3 0,0.06; P$4 2.5,0.06; P$5 5,0.06
1X01 = drill 1.016 octagon: 1 0,0
1X05 = drill 1.016 long: 1 -5.08,0; 2 -2.54,0; 3 0,0; 4 2.54,0; 5 5.08,0
1X04_ROUND_76 = drill 1 pad 1.93: 1 -3.81,0; 2 -1.27,0; 3 1.27,0; 4 3.81,0
MICROBUILDER_1X06_ROUND_76 = drill 1 pad 1.93: 1 -6.35,0; 2 -3.81,0; 3 -1.27,0; 4 1.27,0; 5 3.81,0; 6 6.35,0
1X06 = drill 1.016 long: 1 -6.35,0; 2 -3.81,0; 3 -1.27,0; 4 1.27,0; 5 3.81,0; 6 6.35,0
HC49/S = drill 0.813: 1 -2.413,0; 2 2.413,0
SOT23-WIDE = smd 1 x 1.2: 1 -0.95,-1; 2 0.95,-1; 3 0,1
R0805 = smd 1.1 x 1.4: 1 -1,0; 2 1,0
R0805' = smd 1.3 x 1.5: 1 -0.95,0; 2 0.95,0
_0805MP = smd 1.2 x 1.3: 1 -1.016,0; 2 1.016,0
RESC3216X125N = smd 1.2 x 1.82: 1 -1.505,0; 2 1.505,0
SW_1825910-6-4 = drill 0.99 square: 1 -3.25,2.25 | drill 0.99: 2 3.25,2.25; 3 -3.25,-2.25; 4 3.25,-2.25
CHIP-LED0805 = smd 1.2 x 1.2: A 0,-1.05; C 0,1.05
TO220CS = drill 1.016 long: A 0,-2.54; C -2.54,-2.54; G 2.54,-2.54
SOT223 = smd 2.235 x 1.219: 1 -3.099,2.311; 2 -3.099,0; 3 -3.099,-2.311 | smd 2.2 x 3.6: 4 3.099,0
QFP50P900X900X160-48N = smd 1.56 x 0.28: 1 -4.18,2.75; 2 -4.18,2.25; 3 -4.18,1.75; 4 -4.18,1.25; 5 -4.18,0.75; 6 -4.18,0.25; 7 -4.18,-0.25; 8 -4.18,-0.75; 9 -4.18,-1.25; 10 -4.18,-1.75; 11 -4.18,-2.25; 12 -4.18,-2.75; 25 4.18,-2.75; 26 4.18,-2.25; 27 4.18,-1.75; 28 4.18,-1.25; 29 4.18,-0.75; 30 4.18,-0.25; 31 4.18,0.25; 32 4.18,0.75; 33 4.18,1.25; 34 4.18,1.75; 35 4.18,2.25; 36 4.18,2.75 | smd 0.28 x 1.56: 13 -2.75,-4.18; 14 -2.25,-4.18; 15 -1.75,-4.18; 16 -1.25,-4.18; 17 -0.75,-4.18; 18 -0.25,-4.18; 19 0.25,-4.18; 20 0.75,-4.18; 21 1.25,-4.18; 22 1.75,-4.18; 23 2.25,-4.18; 24 2.75,-4.18; 37 2.75,4.18; 38 2.25,4.18; 39 1.75,4.18; 40 1.25,4.18; 41 0.75,4.18; 42 0.25,4.18; 43 -0.25,4.18; 44 -0.75,4.18; 45 -1.25,4.18; 46 -1.75,4.18; 47 -2.25,4.18; 48 -2.75,4.18
DIP880W50P254L780H450Q6 = drill 0.8 pad 1.2 square: 1 -4.4,2.54 | drill 0.8 pad 1.2: 2 -4.4,0; 3 -4.4,-2.54; 4 4.4,-2.54; 5 4.4,0; 6 4.4,2.54
SOIC127P600X175-14N = smd 2.057 x 0.61: 1 -4.801,7.62; 2 -4.801,6.35; 3 -4.801,5.08; 4 -4.801,3.81; 5 -4.801,2.54; 6 -4.801,1.27; 7 -4.801,0; 8 0,0; 9 0,1.27; 10 0,2.54; 11 0,3.81; 12 0,5.08; 13 0,6.35; 14 0,7.62
GPS = drill 1.016 long: 1 1.524,37.973; 2 4.064,37.973; 3 6.604,37.973; 4 9.144,37.973; 5 11.684,37.973; 6 14.224,37.973; 7 16.764,37.973; 8 19.304,37.973; 9 21.844,37.973; 10 24.384,37.973; 11 26.924,37.973; 12 29.464,37.973; 13 32.004,37.973; 14 34.544,37.973; 15 37.084,37.973; 16 1.499,2.337; 17 4.039,2.337; 18 6.579,2.337; 19 9.119,2.337; 20 11.659,2.337; 21 14.199,2.337; 22 16.739,2.337; 23 19.279,2.337; 24 21.819,2.337; 25 24.359,2.337; 26 26.899,2.337; 27 29.439,2.337; 28 31.979,2.337; 29 34.519,2.337; 30 37.059,2.337
MICROBUILDER_BNO055 = smd 0.25 x 1.016: 1 -2.25,1.833; 6 -2.25,-1.833; 7 -1.75,-1.833; 8 -1.25,-1.833; 9 -0.75,-1.833; 10 -0.25,-1.833; 11 0.25,-1.833; 12 0.75,-1.833; 13 1.25,-1.833; 14 1.75,-1.833; 15 2.25,-1.833; 20 2.25,1.833; 21 1.75,1.833; 22 1.25,1.833; 23 0.75,1.833; 24 0.25,1.833; 25 -0.25,1.833; 26 -0.75,1.833; 27 -1.25,1.833; 28 -1.75,1.833 | smd 1.016 x 0.25: 2 -2.633,0.75; 3 -2.633,0.25; 4 -2.633,-0.25; 5 -2.633,-0.75; 16 2.633,-0.75; 17 2.633,-0.25; 18 2.633,0.25; 19 2.633,0.75
TO92-CLP = drill 0.813 octagon: A 0,1.905; C 1.27,0; R -1.27,0
JST-XH-06-PACKAGE-LONG-PAD = drill 1.016 long: 1 -6.223,0; 2 -3.734,0; 3 -1.245,0; 4 1.245,0; 5 3.734,0; 6 6.223,0
JST-XH-04-PACKAGE-LONG-PAD = drill 1.016 long: 1 -3.734,0; 2 -1.245,0; 3 1.245,0; 4 3.734,0
JST-XH-03-PACKAGE-LONG-PAD = drill 1.016 long: 1 -2.489,0; 2 0,0; 3 2.489,0
CRYSTAL_8X3.8 = smd 1.3 x 1.9: P$1 -2.75,-1.6; P$2 2.75,-1.6; P$3 2.75,1.6; P$4 -2.75,1.6

### Placement (x,y rotation side)
C1  76.94,28.72 90 top
C2  76.84,33.82 90 top
C3  76.84,38.52 90 top
C4  9.46,57.65 0 top
C5  9.45,65.04 0 top
C6  25.97,61.2 270 top
C7  14.92,57.31 90 top
C8  25.02,21.92 270 top
C9  21.41,23.4 180 top
C10  78.09,70.56 0 top
C11  84.26,72.23 0 top
C12  88.6,73.25 0 top
C13  24.7,39.88 90 bottom
C14  29.34,49.77 0 bottom
C15  29.34,45.01 0 bottom
C16  50.55,42.94 180 bottom
C17  13.82,27.24 90 top
C18  43.94,14.48 270 bottom
C19  52.83,14.99 270 bottom
C20  37.08,53.31 180 top
C21  40.39,48.39 90 bottom
C22  36.93,45.72 180 top
C23  50.55,40.7 180 bottom
C24  47.96,48.01 270 bottom
C25  37.08,51.2 180 top
C26  35.56,14.99 270 bottom
C27  54.23,67.56 90 bottom
C28  59.44,34.04 90 bottom
C29  45.97,41.4 90 bottom
C30  57.66,73.66 270 top
C31  2.54,7.62 180 top
C32  10.67,19.56 270 top
C33  48.77,71.37 90 top
CN1  96.9,46.69 90 top
CN2  96.9,64.55 90 top
D1  80.26,74.68 0 top
FTDI  85.58,19.59 0 top
FTDI1  67.59,62.12 270 top
IC1  85.54,34.42 90 top
IC2  84.6,64.2 0 top
IC4  3.56,13.72 90 top
J1  25.19,9.15 180 top
J2  2.05,31.29 270 top
J3  66.55,72.9 0 top
JP1  18.29,41.15 0 bottom
JP2  53.34,55.12 90 top
JP4  19.81,49.78 90 top
JP5  2.03,49.78 270 top
JP11  38.1,56.13 180 top
Q3  32.05,47.39 90 top
Q4  40.2,21.38 180 top
Q5  44.38,21.03 180 bottom
Q6  48.58,21.29 180 top
Q7  52.92,19.77 180 bottom
Q8  31.82,21.63 180 top
Q9  35.9,21.38 180 bottom
R1  89.64,24.62 180 top
R2  87.56,37.91 180 bottom
R3  93.14,28.72 90 bottom
R4  13.88,48.42 270 bottom
R5  85.54,24.62 0 top
R6  16.09,48.42 270 bottom
R7  22.56,67.58 0 top
R8  3.3K  [R0805']  12.45,67.82 270 top
R9  3.3K  [R0805']  9.91,68.58 270 top
R10  47  [R0805']  49.02,61.21 90 bottom
R11  47  [R0805']  58.17,24.64 90 top
R12  46.3,14.27 90 bottom
R13  93.13,57.1 0 bottom
R14  76.31,56.59 180 bottom
R15  74.85,64.09 270 top
R16  74.85,60.09 90 top
R17  10K  [R0805']  18.8,34.92 0 top
R18  10K  [R0805']  37.08,52.37 0 bottom
R19  47  [R0805']  27.37,7.37 270 top
R20  2K  [R0805']  21.59,9.12 180 bottom
R21  40.72,18.16 180 bottom
R22  39.36,25.58 90 top
R23  45.25,25.33 90 top
R24  55.25,14.56 90 bottom
R25  49.04,18.16 180 bottom
R26  48.23,25.4 90 top
R27  53.72,25.33 90 top
R28  37.89,14.91 90 bottom
R29  31.48,17.48 180 bottom
R30  31.55,25.65 90 top
R31  36.78,25.58 90 top
R32  100  [R0805']  12.95,8.76 270 top
R33  14.99,18.54 48.3 top
R34  93.22,73.15 180 top
R35  96.27,53.85 180 top
R36  270  [R0805']  6.6,14.73 270 bottom
R37  100  [R0805']  30.73,38.61 270 top
R40  10k  [R0805']  3.56,33.78 0 top
RDWN  [R0805']  14.48,41.66 180 top
RESET  24.5,39.93 180 top
RUP  [R0805']  10.41,41.66 180 top
RX  93.14,36.92 180 top
RX1  86.85,57.1 90 top
RX2  47.5,56.13 135 top
RX3  58.17,28.7 180 top
RX4  8.38,7.62 270 top
T1  11.43,33.27 180 top
TX  93.14,33.02 0 top
TX1  82.85,57.1 270 top
U1  22.66,29.57 90 top
U2  44.51,46.77 0 top
U3  22.5,14.48 180 top
U4  51.82,70.1 180 top
U$1  60.73,39.13 270 top
U$9  18.74,62.35 90 top
VR1  4.06,38.1 90 top
X1  44.37,66.95 90 top
X2  34.7,67.01 270 top
X3  32.73,11.97 90 top
X4  49.35,12.05 90 top
X5  40.97,12.06 90 top
X6  45.13,35.71 270 top
X7  51.62,35.65 270 top
Y1  9.66,61.37 180 top

### Tracks (layer width: path | path; a pad name or v marks a point on that pad's centre or on a via)
12V_IN
  Top 0.508: 3.58,18.84 IC4.2
  Top 0.762: J2.P$2 13.45,26.34 C17.+ 13.82,23.69 10.67,20.53 C32.1 9.76,20.51 8.09,18.84 3.58,18.84
+3V3  (via drill 0.35)
  Top 0.203: v31.5,29.72 31.55,29.67 R30.2 32.77,25.38 Q8.1 34.04,23.9 v34.04,24.38 | v36.83,29.72 36.83,26.58 R31.2 | v39.37,29.72 39.37,26.55 R22.2 41.15,24.74 Q4.1 41.43,22.38 v42.67,23.62 | v45.21,29.72 45.21,26.32 R23.2 | v48.01,29.72 48.01,26.57 R26.2 49.53,25.04 Q6.1 51.5,22.29 v51.82,22.61 | v53.59,29.72 53.59,26.4 R27.2 | U2.48 41.76,50.18 41.78,50.16 41.14,49.52 U2.1 38.6,49.52 v37.85,48.77 38.03,48.96 C25.1 C20.1 | v36.83,43.69 37.88,44.74 C22.1 38.08,45.52 U2.9 42.22,45.52 v42.42,45.72 | U1.4 22.48,32.85 22.48,54.1 v21.97,54.61 | v48.9,51.31 50.42,51.31 51.69,52.58 JP2.2 | 25.2,32.46 v25.15,32.51 | v12.06,55.5 C7.2 14.92,60.01 15.51,60.6 U$9.28 18.78,60.6 18.99,60.38 U$9.4 U$9.3 | U2.36 46.22,49.52 v45.72,49.02 | JP5.2 4.57,56.13 4.57,65.28 6.92,67.63 R9.2 10.41,67.12 12.19,67.12 R8.2 | 58.28,29.86 RX3.A | R19.2 26.35,6.42 25.15,7.62 25.15,17.53 28.19,20.57 v28.19,29.72
  Top 0.254: U1.4 20.41,34.92 R17.2 | v45.97,46.74 46.76,46.74 47.26,46.23 U2.24 47.26,41.89 v48.01,41.15 | RX3.A 58.13,29.72 | v57.4,54.36 58.17,55.12 58.17,61.98 57.66,62.48 U4.1 55.88,62.48 54.1,64.26 54.1,69.09 53.09,70.1 U4.8 49.09,70.1 C33.1
  Top 0.406: U1.2 22.66,23.7 C9.1 22.36,21.33 v22.61,21.08 | 58.28,29.86 58.13,29.72 v53.59,29.72 53.59,30.73 54.86,32 54.86,36.66 53.4,38.13 X7.1 | U1.4 24.99,32.67 25.2,32.46
  Bottom 0.203: v34.04,24.38 34.95,23.47 Q9.1 | Q5.1 43.43,22.86 v42.67,23.62 | v51.82,22.61 51.82,20.92 Q7.1 | C21.1 40.1,47.72 40.1,47.47 | 40.1,47.47 39.82,47.75 38.86,47.75 v37.85,48.77 | v36.83,43.69 40.1,46.96 40.1,47.47 | v21.97,54.61 21.21,55.37 12.19,55.37 v12.06,55.5 10.16,53.59 JP5.2 | v48.9,51.31 47.96,50.38 C24.1 47.45,48.45 46.29,48.45 v45.72,49.02 | v42.42,45.72 43.43,46.74 v45.97,46.74
  Bottom 0.254: v57.4,54.36 55.63,52.58 JP2.2 50.8,55.12 50.8,60.39 R10.2 | v45.72,49.02 45.97,48.77 v45.97,46.74
  Bottom 0.406: C28.1 56.07,29.72 v53.59,29.72 v48.01,29.72 v45.21,29.72 v39.37,29.72 v36.83,29.72 v31.5,29.72 v28.19,29.72 28.19,29.97 25.65,32.51 v25.15,32.51 22.61,29.97 v22.61,21.08 | X6.1 45.97,39.04 C29.1 46.23,40.45 48.55,38.13 X7.1 49.59,40.17 49.59,40.69 C23.1 | C23.1 C16.1 | C23.1 49.14,41.15 v48.01,41.15
+3V3_LIDAR  (via drill 0.35)
  Top 0.203: IC2.4 82.33,63.3 v82.35,63.32 | v86.87,70.36 86.87,72.51 C12.1 | IC2.17 87.53,68.73 87.88,69.09 89.15,69.09 90.42,67.82 v90.42,67.31
  Bottom 0.203: R14.1 75.31,56.08 78.05,53.34 91.69,53.34 94.13,55.78 R13.1 | v90.42,67.31 90.42,68.58 88.65,70.36 v86.87,70.36 86.87,64.88 85.31,63.32 v82.35,63.32 81.44,63.32 75.31,57.2 R14.1 | R14.1 74.48,56.59 73.41,57.66 73.41,61.47 71.48,63.39 FTDI1.3
+3V3_UART_GPS  (via drill 0.35)
  Top 0.203: v85.14,32.12 IC1.4 90.29,32.14 90.68,31.75 90.68,29.21 v89.92,28.45 | IC1.17 80.86,37.34 80.67,37.53 v79.12,37.53 79.1,37.52 C3.1
  Top 0.254: U$1.12 U$1.11 U$1.10 97.01,14.75 95.5,16.26 95.5,23.74 96.67,24.91 U$1.6 | v67.56,37.59 68.33,36.83 68.33,13.46 v69.6,12.19
  Bottom 0.203: R2.1 86.56,35.82 85.14,34.4 v85.14,32.12 83.1,32.12 81.39,33.83 81.39,36.54 80.39,37.53 v79.12,37.53 | R3.1 92.64,27.21 92.64,26.19 90.09,23.65 87.1,23.65 84.31,20.86 FTDI.3 | 98.69,12.19 U$1.11
  Bottom 0.254: v89.92,28.45 90.65,27.72 R3.1 95.95,24.91 U$1.6 | v69.6,12.19 98.69,12.19 | v67.56,37.59 67.52,37.63 U$1.16
+5V  (via drill 0.35)
  Top 0.406: VR1.C 6.35,41.66 RUP.2 9.4,41.72 v9.4,43.43 | C8.1 25.65,22.87 v27.18,21.34
  Top 0.508: 53.59,74.68 53.61,74.66
  Top 0.762: v54.1,62.74 53.85,62.48 U4.14 50.8,62.48 46.99,58.67 30.99,58.67 26.42,54.1 26.42,48.51 24.38,46.48 24.38,36.07 26.92,33.53 26.92,24.77 C8.1 25.02,26.42 | 53.61,74.66 C30.1 59.85,74.66 J3.P$1 | v51.31,72.39 53.59,74.68 | 18.03,29.72 16.26,31.5 13.21,31.5 11.43,33.27 T1.A v11.43,38.86 | 18.03,29.72 18.03,21.71 R33.2 | 25.02,26.42 U1.3 | 18.03,29.72 23.62,29.72 25.02,28.32 25.02,26.42
  Bottom 0.203: 32.73,17.71 R29.2 | R12.2 46.25,15.24
  Bottom 0.254: v54.1,62.74 54.23,62.74 C27.1
  Bottom 0.305: R21.2 41.73,16.55 X5.4 | R12.2 48.86,15.29 X4.4 | X3.4 32.74,15.68 35.31,15.68 C26.1 37.87,15.94 | X5.4 43.58,15.79 C18.1 44.13,15.24 46.25,15.24 | R24.2 54.88,15.94 C19.1 49.5,15.94 X4.4 | R28.2 40.85,15.92 X5.4 | X4.4 50.05,16.49 R25.2 | 44.44,70.61 X1.5
  Bottom 0.356: R29.2 32.5,15.93 X3.4 | 37.87,15.94 R28.2 | D1.C 74.42,74.68 72.7,72.96 J3.P$5
  Bottom 0.406: v27.18,21.34 30.73,21.34 32.73,19.34 32.73,17.71 | v51.31,72.39 49.28,72.39 47.5,70.61 44.44,70.61 | v11.43,38.86 9.4,40.89 v9.4,43.43
  Bottom 0.508: 61.55,74.2 J3.P$1
  Bottom 0.762: 61.55,74.2 62.61,75.26 70.79,75.26 71.55,74.5 J3.P$5 | v54.1,62.74 51.31,65.53 v51.31,72.39
+5V_JETSON  (via drill 0.35)
  Top 0.203: C1.+ 76.94,32.72 C2.1 78.14,32.82 80.71,35.39 IC1.20 82.91,35.39 84.29,36.77 v84.29,37.13 84.29,38.47 90.91,45.09 CN1.VBUS
+5V_LIDAR
  Top 0.254: C10.+ 81.14,72.23 C11.1 83.26,71.69 85.58,69.38 IC2.20 85.58,66.87 86.35,66.1 87.48,66.1 90.63,62.95 CN2.VBUS
ADC_CH8
  Top 0.203: U2.18 44.26,40.83 45.21,39.88 46.48,39.88 47.75,38.61 47.75,36.58 46.89,35.71 X6.2
ADC_CH9
  Top 0.203: X7.2 49.95,35.65 49.02,36.58 49.02,38.86 47.5,40.39 45.47,40.39 44.76,41.09 U2.19
BOOT0  (via drill 0.35)
  Top 0.203: U2.44 43.76,51.94 42.07,53.64 v40.29,53.64
  Bottom 0.203: v40.29,53.64 39.02,52.37 R18.1
CAP
  Top 0.203: C6.2 24.7,60.25 23.36,61.6 U$9.9
CTS
  Top 0.203: IC1.11 87.31,36.69 83.54,32.92 83.54,26.72 81.77,24.95 FTDI.2
CTS_LIDAR
  Top 0.203: IC2.11 86.88,61.82 82.1,66.6 68.26,66.6 FTDI1.2
D+_GPS
  Top 0.203: IC1.15 81.95,38.64 90.04,46.74 92.79,46.74 CN1.D+
D+_LIDAR
  Top 0.203: CN2.D+ 90.9,64.55 88.83,66.62 IC2.15
D-_GPS
  Top 0.203: IC1.16 81.94,38.02 81.96,37.99 82.82,37.99 90.68,45.85 92.79,45.85 CN1.D-
D-_LIDAR
  Top 0.203: CN2.D- 90.7,63.75 88.17,66.27 IC2.16
GND  (via drill 0.35)
  Top 0.203: v20.27,70.09 18.49,68.31 U$9.18 | IC1.26 IC1.25 80.31,32.14 v79.88,32.57 v79.89,32.57 79.89,33.82 80.81,34.74 IC1.21 | IC1.18 80.4,36.69 v79.12,35.42 | IC1.7 90.86,34.09 v91.14,33.82 | IC2.26 IC2.25 82.33,69.82 v82.3,69.85 84.07,69.85 84.92,69 IC2.21 | FTDI.1 76.94,21.88 C1.- 73.91,30.36 v73.91,35.05 73.91,37.34 76.09,39.52 C3.2 76.94,39.62 81.53,39.62 90.2,48.29 CN1.GND 92.93,48.39 93.58,48.39 95.27,50.07 R35.2 | 65.73,68.47 65.71,68.45 | U2.23 46.76,44.04 46.1,44.7 v45.97,44.7 45.97,45.47 44.96,46.48 44.96,46.99 | U2.8 41.45,46.02 42.42,46.99 43.69,46.99 | 43.69,46.99 44.96,46.99 | C25.2 35.63,50.69 | v40.26,51.56 40.26,51.69 40.89,52.32 41.91,52.32 42.26,51.97 U2.47 42.26,49.18 43.69,47.75 43.69,46.99 | C22.2 35.98,45.63 | 44.96,46.99 46.99,49.02 U2.35 51.56,49.02 52.58,50.04 JP2.1 | C11.2 85.39,72.36 | IC2.7 84.28,63.3 82.8,64.77 v81.53,64.77 | v77.72,68.07 76.72,69.08 C10.- | U$1.15 99.72,2.05 | U$1.13 99.72,7.13 | 20.31,26.43 U1.1 | C5.1 8.5,57.66 C4.1 8.51,55.76 10.1,54.17 12.83,54.17 C7.1 | 89.64,73.21 C12.2 89.7,73.15 R34.2 | 85.39,74.72 85.34,74.68 | U$9.16 19.49,64.72 19.62,64.6 U$9.15 21.67,64.6 23.51,66.44 R7.2 23.51,70.76 v25.91,73.15 28.19,70.87 28.19,64.37 C6.1 25.92,62.1 U$9.10 U$9.25 | 17.99,59.27 U$9.2
  Top 0.254: IC2.18 86.88,68.84 87.88,69.85 89.64,69.85 | CN2.GND 92.84,66.65 89.64,69.85 | 85.39,72.36 85.39,74.72 85.85,75.18 88.65,75.18 89.6,74.23 C12.2 | 17.99,59.27 15.02,56.3 C7.1 | 89.64,73.21 89.64,69.85 | R11.1 58.17,14.84 51.64,8.32 X4.1 | C33.2 47.82,72.32 46.97,73.17 X1.6
  Top 0.305: 35.63,50.69 v35.63,48.96 | 35.98,45.63 35.56,45.21 v35.56,42.93 | C25.2 C20.2 34.58,53.31 v34.04,53.85 | v27.18,58.17 27.18,61.71 26.73,62.15 C6.1 | v14.99,43.94 14.99,55.49 C7.1
  Top 0.356: 55.6,71.14 55.6,71.12 | C10.- 76.72,72.08 79.31,74.68 D1.A 85.34,74.68
  Top 0.406: U$1.26 U$1.27 | 99.72,2.05 100.84,3.17 100.84,6.01 99.72,7.13 | v71.12,9.65 v71.12,35.05 | C30.2 57.42,72.9 | v34.04,53.85 34.04,55.88 JP11.5 | JP11.5 JP11.6 | JP11.5 JP11.4 | v79.12,35.42 78.52,34.82 C2.2 | T1.C 13.97,39.17 15.43,40.63 RDWN.1 | v2.54,32 2.54,33.72 R40.1
  Top 0.508: C10.- 74.64,68.47 FTDI1.1 | J3.P$4 68.92,72.83 | 2.7,17.12 IC4.3 3.53,17.14 | R32.1 v12.95,14.22
  Top 0.762: 65.73,68.47 FTDI1.1 67.59,70.38 68.92,71.71 68.92,72.83 | 65.71,68.45 60.05,68.45 58.4,70.1 U4.7 55.6,71.12 | 55.6,71.14 55.12,71.63 v55.12,72.9 57.42,72.9 | 2.7,17.12 1.52,18.29 1.52,27.81 2.55,28.84 J2.P$1 | 3.53,17.14 2.8,17.14 1.59,15.93 C31.2 | C32.2 9.18,17.12 IC4.3 | 20.31,26.43 20.46,26.28 C9.2 20.46,19.93 v22.35,18.03 24.13,18.03 25.02,18.93 C8.2
  Bottom 0.203: v79.12,35.42 79.12,33.32 v79.88,32.57 81.63,30.82 85.89,30.82 88.89,33.82 v91.14,33.82 91.17,33.78 93.73,33.78 97.55,37.61 U$1.1 | 51.56,43 51.56,43.43 47.96,47.03 C24.2 47.96,46.69 v45.97,44.7 C29.2 | v35.63,48.96 35.63,49.72 36.2,50.29 39.43,50.29 C21.2 40.39,51.43 v40.26,51.56 | v81.53,64.77 81.03,64.77 v77.72,68.07 79.5,69.85 v82.3,69.85 | 40.88,8.23 X5.1 43.43,10.79 43.43,13.02 C18.2 | X4.1 | v20.27,70.09 23.33,73.15 v25.91,73.15 | v18.03,43.94 18.03,45.53 R6.2 R4.2 | C26.2 35.05,13.53 35.05,10.41 32.87,8.23 X3.1 | C19.2 52.32,13.53 52.32,10.8 49.85,8.33 | JP2.1 58.42,44.96 58.42,37.83 59.44,36.81 C28.2
  Bottom 0.254: C27.2 55.12,69.4 v55.12,72.9
  Bottom 0.305: v35.63,48.96 35.63,45.28 35.56,45.21 v35.56,42.93 | C14.2 27.18,50.97 v27.18,58.17 | 34.77,73.17 X2.1 | R18.2 35.52,52.37 v34.04,53.85
  Bottom 0.356: X2.1 25.99,73.24 v25.91,73.15 | v55.12,72.9 53.85,74.17 45.37,74.17 X1.6 34.77,73.17
  Bottom 0.406: v22.35,18.03 24.89,15.49 24.89,10.16 26.82,8.23 X3.1 40.88,8.23 | C15.2 C14.2 28.39,52.26 29.97,53.85 v34.04,53.85 | C15.2 27.32,43.94 21.34,43.94 | 21.34,43.94 v18.03,43.94 v14.99,43.94 13.34,43.94 6.22,51.05 JP5.3 | X4.1 58.61,8.32 59.98,9.69 U$1.27 63.11,9.65 v71.12,9.65 94.23,9.65 96.76,7.13 U$1.13 | X5.1 X4.1 49.85,8.33 | 21.34,43.94 21.34,42.27 RESET.4 22.6,40.83 C13.2 26.39,40.83 RESET.3 28.39,42.82 C15.2 | X6.3 51.55,33.22 X7.3 51.74,33.28 55.12,33.28 56.82,34.99 C28.2 59.54,35.09 U$1.17 71.08,35.09 v71.12,35.05 v73.91,35.05 78.76,35.05 v79.12,35.42 | C23.2 C16.2 51.56,43 | J2.P$1 2.54,31.75 v2.54,32
  Bottom 0.508: IC4.3 5.17,17.12 R36.1 11.5,15.68 v12.95,14.22
  Bottom 0.762: v22.35,18.03 17.78,22.61 17.78,27.94 17.21,28.51 C17.- | J2.P$1 13.49,28.84 C17.- | T1.C 13.82,35.67 C17.-
  pour Top: 0.25,0.25 101.35,0.25 101.35,0.76 101.35,75.95 99.82,75.95 0.25,75.95 0.25,75.69
  pour Bottom: 0.25,0.25 101.35,0.25 101.35,75.95 0.25,75.95 0.25,75.69
I2CADDR_3V  (via drill 0.35)
  Top 0.203: v29.72,67.56 30.73,66.55 30.73,60.2 25.53,54.99 v25.15,54.99 | R7.1 19.82,67.58 v19.81,67.56 v19.81,67.55 18.99,66.73 U$9.17
  Bottom 0.203: v19.81,67.56 v29.72,67.56 | v25.15,54.99 25.15,50.55 20.57,45.97 JP4.1
INT_3V  (via drill 0.35)
  Top 0.203: v23.75,59.82 v23.75,51.31 | v23.18,64.11 20.59,64.11 U$9.14
  Bottom 0.203: v23.18,64.11 23.18,60.39 v23.75,59.82 | v23.75,51.31 20.95,48.51 JP4.2
LED
  Top 0.254: RX2.C 45.76,54.4 U2.40
M1_TX
  Top 0.203: U3.2 29.34,16.93 29.34,33.78 39.57,44.02 U2.12
MISO_5V
  Top 0.203: U4.12 48.01,65.02 46.19,63.21 X1.2
MOSI_5V
  Top 0.203: X1.1 45.99,60.72 49.02,63.75 U4.13
N$1
  Top 0.203: C4.2 12.41,59.66 Y1.P$4 13.74,61.1 U$9.27
N$2
  Top 0.203: R1.1 91.93,23.33 FTDI.6
N$3  (via drill 0.35)
  Top 0.254: v49.02,58.17 49.02,57.66 RX2.A
  Bottom 0.254: v49.02,58.17 R10.1
N$4
  Top 0.254: RX3.C R11.2
N$5
  Top 0.203: R5.2 86.54,25.42 88.65,27.53 88.65,29.68 IC1.1
N$6
  Top 0.203: TX.C 90.54,36.67 90.54,39.32 89.64,40.22 87.89,40.22 86.71,39.04 86.71,36.99 83.14,33.42 81.94,33.42 IC1.23
N$7
  Top 0.203: RX.C 91.14,37.87 91.14,39.62 89.94,40.82 87.54,40.82 86.21,39.49 86.21,37.29 83.01,34.09 IC1.22
N$8  (via drill 0.35)
  Top 0.203: v93.22,39.88 93.22,38.04 RX.A
  Bottom 0.203: R2.2 91.25,37.91 v93.22,39.88
N$9  (via drill 0.35)
  Top 0.203: v95.5,31.5 95.03,31.97 TX.A
  Bottom 0.203: R3.2 93.72,29.72 v95.5,31.5
N$10
  Top 0.203: C5.2 10.41,65.04 10.41,64.97 Y1.P$1 13.79,61.6 U$9.26
N$11
  Top 0.203: R34.1 96.01,71.36 96.01,68.58 97.28,67.31 97.28,66.04 96.52,65.28 92.9,65.28 CN2.ID
N$12
  Top 0.508: R32.2 12.76,7.62 RX4.C
N$13
  Top 0.203: R35.1 97.27,52.82 96.77,52.32 96.77,50.16 97.41,49.53 97.41,48.13 96.77,47.5 CN1.ID
N$14
  Top 0.203: TX1.C 85.9,59.1 89.35,59.1 89.85,59.6 89.85,61.85 87.1,64.6 85.1,64.6 83.62,66.07 IC2.23
N$15
  Top 0.203: RX1.C 87.3,58.6 89.85,58.6 90.6,59.35 90.6,62.1 87.91,64.79 87.35,65.35 85.35,65.35 84.28,66.42 IC2.22
N$16  (via drill 0.35)
  Top 0.203: RX1.A 87.9,56.59 89.88,54.61 v89.92,54.61
  Bottom 0.203: R13.2 92.13,56.59 90.15,54.61 v89.92,54.61
N$17  (via drill 0.35)
  Top 0.203: TX1.A 81.8,56.84 81.79,56.83 81.79,56.39 v80.01,54.61
  Bottom 0.203: v80.01,54.61 79.29,54.61 R14.2
N$18
  Top 0.203: IC2.1 78.89,60.57 76.37,63.09 R15.2
N$19
  Top 0.203: R16.1 70.91,59.09 FTDI1.6
N$20
  Bottom 0.406: IC4.5 6.54,13.72 R36.2
N$21
  Top 0.508: IC4.4 5.67,15.42 5.84,15.24 5.84,12.95 3.72,10.83 3.72,7.85 C31.1 RX4.A
  Top 0.762: R33.1 11.98,15.42 IC4.4
N$22  (via drill 0.35)
  Top 0.203: Q4.3 39.89,20.07 38.35,20.07 v37.85,19.56 37.85,16.43 X5.3
  Bottom 0.203: v37.85,19.56 39.25,18.16 R21.1
N$23  (via drill 0.35)
  Top 0.203: v44.45,18.03 44.96,17.53 v44.96,11.18 44.6,10.81 X5.2
  Bottom 0.203: R12.1 44.96,11.91 v44.96,11.18 | Q5.3 44.38,18.1 v44.45,18.03
N$24
  Top 0.406: T1.G 6.54,35.81 R40.2 4.51,34.29 2.16,36.64 VR1.A
N$25
  Top 0.406: RDWN.2 RUP.1 11.36,40.83 9.65,39.12 8.89,39.12 6.61,36.84 6.61,36.83 VR1.R
N$26  (via drill 0.35)
  Top 0.203: Q6.3 45.97,17.68 v45.97,17.02 45.97,15.75 48.45,13.27 49.33,13.27 X4.3
  Bottom 0.203: R25.1 47.12,18.16 v45.97,17.02
N$27  (via drill 0.35)
  Top 0.203: v53.59,11.94 52.46,10.8 X4.2
  Bottom 0.203: Q7.3 54.64,18.77 56.9,16.51 56.9,14.73 55.71,13.54 R24.1 53.64,11.94 v53.59,11.94
N$28  (via drill 0.35)
  other vias: 44.7,48.01
N$29
  Top 0.203: U3.1 26.9,8.79 R19.1
N$36
  Top 0.203: U2.5 34.33,47.52 Q3.2
  Bottom 0.203: C14.1 30.32,49.8 Q3.2
N$37
  Top 0.203: Q3.1 32.31,44.97 34.35,47.02 U2.6
  Bottom 0.203: Q3.1 32.01,45.01 C15.1
N$48  (via drill 0.35)
  Top 0.203: Q8.3 30.75,19.56 v30.48,19.56
  Bottom 0.203: v30.48,19.56 30.46,19.54 R29.1 30.46,15.47 X3.3
N$49  (via drill 0.35)
  Top 0.203: v35.81,18.03 36.58,17.27 v36.58,11.68 35.61,10.72 X3.2
  Bottom 0.203: R28.1 36.58,12.58 v36.58,11.68 | Q9.3 35.9,18.12 v35.81,18.03
NRESET_3V  (via drill 0.35)
  Top 0.203: JP5.6 10.16,51.56 v11.18,51.56 | v26.16,70.48 v26.16,65.02 26.18,65.02 23.76,62.6 U$9.11 | v16.89,56.39 16.38,55.88 v16.38,52.32
  Bottom 0.203: X2.2 34.44,70.48 v26.16,70.48 | v26.16,65.02 26.29,64.9 26.29,60.58 22.1,56.39 v16.89,56.39 | v16.38,52.32 15.62,51.56 v11.18,51.56
NRST  (via drill 0.35)
  Top 0.203: v42.29,47.88 42.18,47.77 42.18,47.52 41.18,46.52 U2.7 | JP2.5 47.75,54.61 v47.75,53.34 | R37.1 30.8,39.62 v32.77,39.62
  Bottom 0.203: v32.77,39.62 35.17,39.62 42.29,46.75 v42.29,47.88 v47.75,53.34
NSS_5V
  Top 0.203: X1.4 45,67.56 U4.10
PS0_3V
  Top 0.203: U$9.6 20.57,54.35 JP4.4
  Bottom 0.203: R4.1 13.88,49.69 14.99,50.8 17.02,50.8 JP4.4
PS1_3V
  Top 0.203: JP4.3 18.15,52.72 18.15,56.85 19.49,58.19 U$9.5
  Bottom 0.203: R6.1 18.13,49.37 JP4.3
RESET
  Top 0.203: R37.2 27.77,37.66 RESET.1 | RESET.2 20.14,36.58 19.5,36.58 R17.1
  Top 0.406: JP1.1 17.85,40.71 R17.1
  Bottom 0.203: RESET.2 23.45,37.68 C13.1 25.94,37.68 RESET.1
RTS
  Top 0.203: IC1.3 86.71,31.49 85.54,30.32 85.54,22.82 86.25,22.1 87.88,22.1 88.64,22.85 R1.2
RTS_LIDAR
  Top 0.203: R16.2 73.86,61.09 73.37,61.58 73.37,63.6 73.86,64.09 79.58,64.09 81.67,62 IC2.3
RX_GPS
  Top 0.203: FTDI.4 86.85,20.09 84.58,22.35 84.58,24.57 R5.1
  Bottom 0.203: FTDI.4 86.85,18.52 85.34,17.02 72.9,17.02 67.52,22.39 U$1.22
RX_JETSON  (via drill 0.35)
  Top 0.203: U2.31 51.59,47.02 52.07,47.5 v53.34,47.5
  Bottom 0.203: v53.34,47.5 50.93,49.91 50.93,53.98 45.94,58.96 39.52,58.96 35.21,63.28 X2.5
RX_LIDAR  (via drill 0.35)
  Top 0.203: FTDI1.5 68.61,58.31 69.62,59.33 69.62,62.51 v72.39,65.28 74.66,65.28 R15.1
  Bottom 0.203: v72.39,65.28 72.39,66.8 66.55,72.64 J3.P$3
SABERTOOTH_5V
  Bottom 0.203: 22.54,5.95 J1.P$1
  Bottom 0.406: R20.2 22.54,5.95
SABERTOOTH_GND
  Top 0.406: U3.4 18.1,16.52 15.49,13.91 15.49,8 J1.P$3
SABERTOOTH_S1
  Top 0.406: U3.5 16.76,13.15 16.76,10.16 20.24,6.68 J1.P$2
  Bottom 0.406: R20.1 20.32,8.8 20.32,5.82 J1.P$2
SCK_5V
  Top 0.203: X1.3 44.97,66.29 U4.11
SCL_3V  (via drill 0.35)
  Top 0.203: v7.62,55.12 7.62,51.56 JP5.5 | R9.1 10.73,70.36 14.99,70.36 16.74,68.6 v16.74,66.67 17.99,65.42 U$9.19
  Bottom 0.203: X2.3 34.19,68.26 32.19,66.26 17.15,66.26 v16.74,66.67 7.62,57.54 v7.62,55.12
SDA_3V  (via drill 0.35)
  Top 0.203: X2.4 34.05,65.77 v30.99,68.83 | v4.83,55.12 4.83,51.31 JP5.4 | R8.1 12.95,69.28 14.32,69.28 14.69,68.91 v14.72,68.91 14.72,65.93 16.05,64.6 U$9.20
  Bottom 0.203: v30.99,68.83 14.79,68.83 v14.72,68.91 14.72,68.06 4.83,58.17 v4.83,55.12
SPI2_MISO_3V3
  Top 0.203: U2.27 50.49,45.02 51.31,44.2 52.58,44.2 59.94,51.56 59.94,63.25 58.17,65.02 U4.3
SPI2_MOSI_3V3
  Top 0.203: U4.2 58.17,63.75 59.18,62.74 59.18,51.56 52.32,44.7 51.56,44.7 50.75,45.52 U2.28
SPI2_NSS_3V3
  Top 0.203: U4.5 58.17,67.56 61.47,64.26 61.47,51.56 53.09,43.18 50.8,43.18 49.96,44.02 U2.25
SPI2_SCK_3V3
  Top 0.203: U2.26 50.22,44.52 51.05,43.69 52.83,43.69 60.71,51.56 60.71,63.75 58.17,66.29 U4.4
SWCLK
  Top 0.203: U2.37 51.43,55.12 JP2.3
SWDIO
  Top 0.203: U2.34 54.61,48.52 55.63,49.54 55.63,56.38 54.36,57.66 JP2.4
TEST_GPIO1
  Top 0.203: U2.43 44.26,52.51 42.67,54.1 41.15,54.1 39.37,55.88 JP11.3
TEST_GPIO2
  Top 0.203: U2.42 44.76,53.03 41.91,55.88 JP11.2
TEST_GPIO3
  Top 0.203: U2.41 45.26,55.32 JP11.1
TX_GPS  (via drill 0.35)
  Top 0.203: IC1.5 90.57,32.79 91.3,32.06 91.3,28.18 89.64,26.52 89.64,19.84 FTDI.5 86.06,16.26 76.45,16.26 74.17,18.54 v74.17,26.92
  Bottom 0.203: v74.17,26.92 63.62,26.92 U$1.20
TX_JETSON  (via drill 0.35)
  Top 0.203: U2.30 52.03,46.52 v52.07,46.48
  Bottom 0.203: v52.07,46.48 52.07,47.5 50.29,49.28 50.29,53.59 45.89,58 37.49,58 X2.6
TX_LIDAR  (via drill 0.35)
  Top 0.203: IC2.5 82.97,59.35 82.04,58.42 77.98,58.42 76.33,60.07 72.01,60.07 v71.63,60.45 | v65.53,70.1 64.05,71.59 J3.P$2
  Bottom 0.203: v71.63,60.45 71.23,60.85 FTDI1.4 65.53,62.91 v65.53,70.1
US1_ECHO  (via drill 0.35)
  Top 0.203: R31.1 35.56,24.64 34.29,25.91 v34.29,26.42 34.29,36.58 v38.35,40.64 | U2.11 41.33,44.52 41.91,43.94 44.58,43.94 v44.83,44.2
  Bottom 0.203: v34.29,26.42 34.29,25.91 35.31,24.89 35.31,23.88 36.8,22.38 Q9.2 | v44.83,44.2 43.18,44.2 39.62,40.64 v38.35,40.64
US1_TRIG  (via drill 0.35)
  Top 0.203: v39.37,42.16 38.61,42.16 30.23,33.78 30.23,25.26 30.78,24.7 R30.1 30.87,24.02 Q8.2 | U2.10 41.41,45.02 42.08,44.35 43.69,44.35 44.2,44.86 v44.2,45.47
  Bottom 0.203: v39.37,42.16 40.39,42.16 43.69,45.47 v44.2,45.47
US2_ECHO  (via drill 0.35)
  Top 0.203: R23.1 44.99,24.64 43.94,24.64 42.8,25.78 v42.8,26.92 42.8,27.18 40.28,29.7 40.28,38.56 42.76,41.05 U2.15
  Bottom 0.203: v42.8,26.92 42.93,26.8 42.93,24.89 45.33,22.49 Q5.2
US2_TRIG
  Top 0.203: Q4.2 39.36,22.49 R22.1 38.85,24.63 38.1,25.39 38.1,37.21 42.26,41.38 U2.14
US3_ECHO  (via drill 0.35)
  Top 0.203: v55.12,22.35 55.12,22.98 R27.1 52.7,24.38 50.8,26.28 50.8,29.72 49.02,31.5 43.69,31.5 42.42,32.77 42.42,38.65 43.76,39.99 U2.17
  Bottom 0.203: v55.12,22.35 55.12,22.02 Q7.2
US3_TRIG
  Top 0.203: Q6.2 47.72,22.38 47.72,23.94 R26.1 47.72,24.45 46.81,25.35 46.81,29.64 45.85,30.61 42.55,30.61 41.02,32.13 41.02,38.22 43.26,40.46 U2.16

### Text on the board
tNames: ECE477 Group 9 | Jetson | Display | Tantalum | D2U PCB v2 | GND | CTS | +3V3J | FT232RL | NRST | TX | SWDIO | RX | SWCLK | RTS | +3V3 | GND | RST | RIGHT ENCODER | LEFT ENCODER | Tantalum | FT232RL | 12V IN | RST FUSE | GND | CTS | +3V3J | RX | TX | RTS | 12V TO 5V SWR | MC S1 | US1 | US2 | US3 | Luke Armbruster | Keith Aylwin | Michael Karrs | Troy Conlin